# Altium project RockRTK.PrjPcb (part 2 of 2)

## Sheet SoC_Peripheral.SchDoc
size A4; SheetNumber: 21; SheetTotal: 22
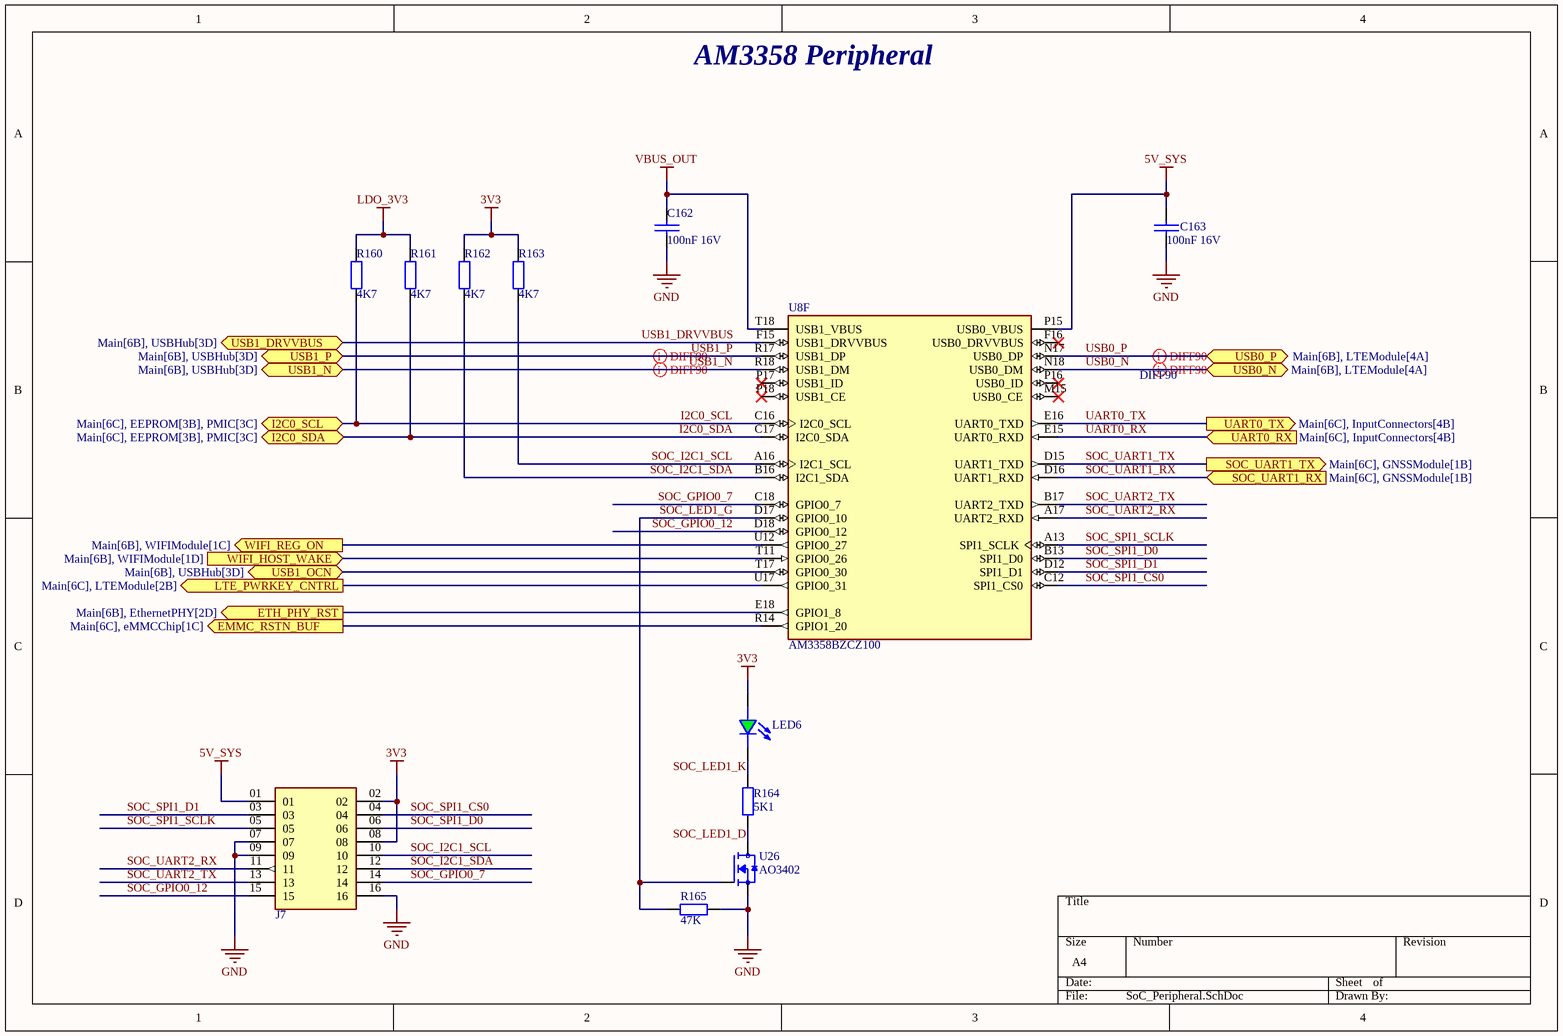
[diagram p12: SoC_Peripheral.SchDoc]

### Parts
C162  100nF 16V  [C_0402]
C163  100nF 16V  [C_0402]
J7  header_2.54_16pin_2row  [header_2.54_16pin_2row]  (value not drawn)
LED6  LED_0603_GREEN  [LED_0603]  (value not drawn)
R160  4K7  [R_0402]
R161  4K7  [R_0402]
R162  4K7  [R_0402]
R163  4K7  [R_0402]
R164  5K1  [R_0603]
R165  47K  [R_0603]
U8  AM3358BZCZ100  [BGA324C80P18X18_1500X1500X140]  (part F of 9)
U26  AO3402  [SOT-23-3]

### Ports
EMMC_RSTN_BUF (out, see Main[6C], eMMCChip[1C]), ETH_PHY_RST (out, see Main[6B], EthernetPHY[2D]), I2C0_SCL (bidir, see Main[6C], EEPROM[3B], PMIC[3C]), I2C0_SDA (bidir, see Main[6C], EEPROM[3B], PMIC[3C]), LTE_PWRKEY_CNTRL (out, see Main[6C], LTEModule[2B]), SOC_UART1_RX (in, see Main[6C], GNSSModule[1B]), SOC_UART1_TX (out, see Main[6C], GNSSModule[1B]), UART0_RX (in, see Main[6C], InputConnectors[4B]), UART0_TX (out, see Main[6C], InputConnectors[4B]), USB0_N (bidir, see Main[6B], LTEModule[4A]), USB0_P (bidir, see Main[6B], LTEModule[4A]), USB1_DRVVBUS (bidir, see Main[6B], USBHub[3D]), USB1_N (bidir, see Main[6B], USBHub[3D]), USB1_OCN (bidir, see Main[6B], USBHub[3D]), USB1_P (bidir, see Main[6B], USBHub[3D]), WIFI_HOST_WAKE (in, see Main[6B], WIFIModule[1D]), WIFI_REG_ON (out, see Main[6B], WIFIModule[1C])

### Nets
3V3: J7.02 J7.08 LED6.1(A) R162.2 R163.2
5V_SYS: C163.1 J7.01 U8.P15(USB0_VBUS)
GND: C162.2 C163.2 J7.07 J7.09 J7.16 R165.2 U26.2(S)
LDO_3V3: R160.2 R161.2
VBUS_OUT: C162.1 U8.T18(USB1_VBUS)
EMMC_RSTN_BUF: U8.R14(GPIO1_20) ; port EMMC_RSTN_BUF
ETH_PHY_RST: U8.E18(GPIO1_8) ; port ETH_PHY_RST
I2C0_SCL: R160.1 U8.C16(I2C0_SCL) ; port I2C0_SCL
I2C0_SDA: R161.1 U8.C17(I2C0_SDA) ; port I2C0_SDA
LTE_PWRKEY_CNTRL: U8.U17(GPIO0_31) ; port LTE_PWRKEY_CNTRL
SOC_GPIO0_7: J7.14 U8.C18(GPIO0_7)
SOC_GPIO0_12: J7.15 U8.D18(GPIO0_12)
SOC_I2C1_SCL: J7.10 R163.1 U8.A16(I2C1_SCL)
SOC_I2C1_SDA: J7.12 R162.1 U8.B16(I2C1_SDA)
SOC_LED1_D: R164.1 U26.3(D)
SOC_LED1_G: R165.1 U8.D17(GPIO0_10) U26.1(G)
SOC_LED1_K: LED6.2(C) R164.2
SOC_SPI1_CS0: J7.04 U8.C12(SPI1_CS0)
SOC_SPI1_D0: J7.06 U8.B13(SPI1_D0)
SOC_SPI1_D1: J7.03 U8.D12(SPI1_D1)
SOC_SPI1_SCLK: J7.05 U8.A13(SPI1_SCLK)
SOC_UART1_RX: U8.D16(UART1_RXD) ; port SOC_UART1_RX
SOC_UART1_TX: U8.D15(UART1_TXD) ; port SOC_UART1_TX
SOC_UART2_RX: J7.11 U8.A17(UART2_RXD)
SOC_UART2_TX: J7.13 U8.B17(UART2_TXD)
UART0_RX: U8.E15(UART0_RXD) ; port UART0_RX
UART0_TX: U8.E16(UART0_TXD) ; port UART0_TX
USB0_N: U8.N18(USB0_DM) ; port USB0_N
USB0_P: U8.N17(USB0_DP) ; port USB0_P
USB1_DRVVBUS: U8.F15(USB1_DRVVBUS) ; port USB1_DRVVBUS
USB1_N: U8.R18(USB1_DM) ; port USB1_N
USB1_OCN: U8.T17(GPIO0_30) ; port USB1_OCN
USB1_P: U8.R17(USB1_DP) ; port USB1_P
WIFI_HOST_WAKE: U8.T11(GPIO0_26) ; port WIFI_HOST_WAKE
WIFI_REG_ON: U8.U12(GPIO0_27) ; port WIFI_REG_ON

Not connected (* = marked no-connect by the designer): U8 F16(USB0_DRVVBUS)* M15(USB0_CE)* P16(USB0_ID)* P17(USB1_ID)* P18(USB1_CE)*

### Layout directives
differential pair; differential pair class DIFF90: USB0_N, USB0_P, USB1_N, USB1_P

### Notes on the sheet
- AM3358 Peripheral

### Library data of the parts
C162 C163 = C_0402: Capacitor 0402 SMD
R160-R163 = R_0402: Resistor 0402 SMD
R164 R165 = R_0603: Resistor 0603 SMD
U8 = AM3358BZCZ100: as U8 on sheet SoC_DDR; Manufacturer Part Number: AM3358BZCZ100; Datasheet Link: https://www.ti.com/lit/ds/symlink/am3358.pdf
U26 = AO3402: N-Channel 30 V 4A (Ta) 1.4W (Ta) Surface Mount SOT-23-3; Manufacturer: Alpha & Omega Semicon; Manufacturer Part Number: AO3402; ComponentLink1Description: Datasheet Link; ComponentLink1URL: https://www.lcsc.com/datasheet/lcsc_datasheet_2410121835_Alpha---Omega-Semicon-AO3402_C14385.pdf

## Sheet USBHub.SchDoc
size A4; SheetNumber: 10; SheetTotal: 22
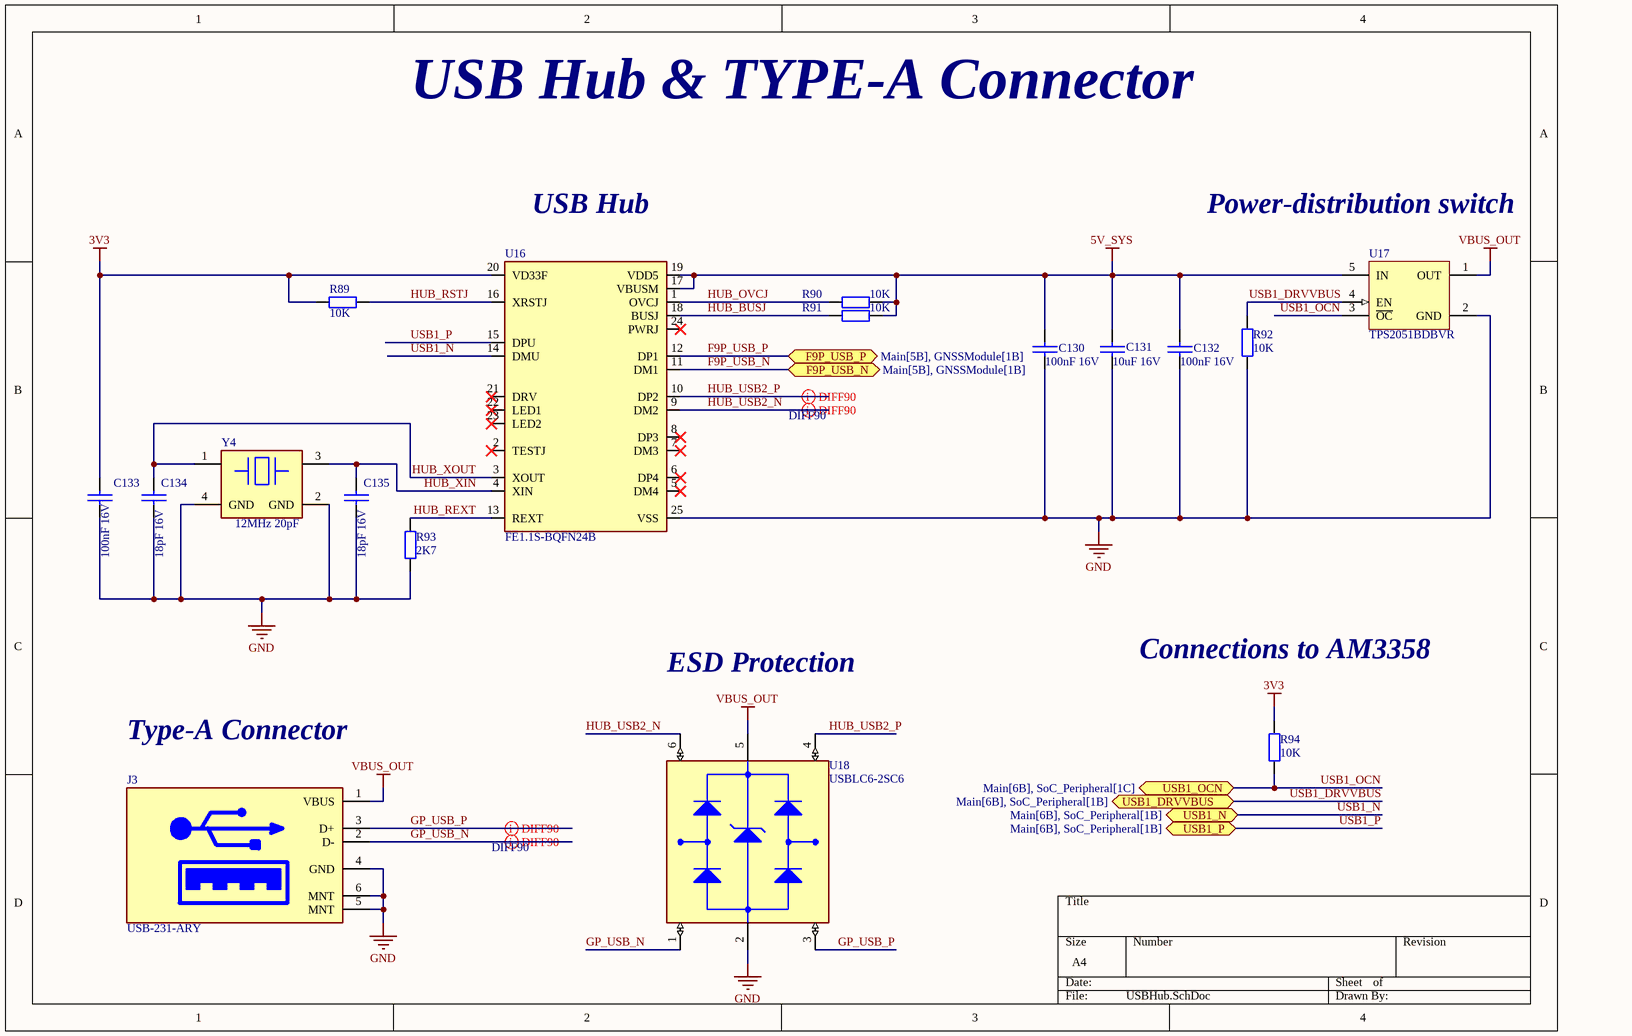
[diagram p13: USBHub.SchDoc]

### Parts
C130  100nF 16V  [C_0402]
C131  10uF 16V  [C_0603]
C132  100nF 16V  [C_0402]
C133  100nF 16V  [C_0402]
C134  18pF 16V  [C_0402]
C135  18pF 16V  [C_0402]
J3  USB-231-ARY  [TYPE-A_W14xD14.45xH7]
R89  10K  [R_0402]
R90  10K  [R_0402]
R91  10K  [R_0402]
R92  10K  [R_0402]
R93  2K7  [R_0402]
R94  10K  [R_0402]
U16  FE1.1S-BQFN24B  [QFN50P400X400X80-25N-D]
U17  TPS2051BDBVR  [DBV0005A_L]
U18  USBLC6-2SC6  [SOT-23-6]
Y4  12MHz 20pF  [CRYSTAL_SMD3225-4P]

### Ports
F9P_USB_N (bidir, see Main[5B], GNSSModule[1B]), F9P_USB_P (bidir, see Main[5B], GNSSModule[1B]), USB1_DRVVBUS (bidir, see Main[6B], SoC_Peripheral[1B]), USB1_N (bidir, see Main[6B], SoC_Peripheral[1B]), USB1_OCN (bidir, see Main[6B], SoC_Peripheral[1C]), USB1_P (bidir, see Main[6B], SoC_Peripheral[1B])

### Nets
3V3: C133.1 R89.2 R94.1 U16.20(VD33F)
5V_SYS: C130.1 C131.1 C132.1 R90.1 R91.1 U16.17(VBUSM) U16.19(VDD5) U17.5(IN)
GND: C130.2 C131.2 C132.2 C133.2 C134.1 C135.1 J3.4(GND) J3.5(MNT) J3.6(MNT) R92.2 R93.1 U16.25(VSS) U17.2(GND) U18.2(GND) Y4.2(GND) Y4.4(GND)
VBUS_OUT: J3.1(VBUS) U17.1(OUT) U18.5(VBUS)
F9P_USB_N: U16.11(DM1) ; port F9P_USB_N
F9P_USB_P: U16.12(DP1) ; port F9P_USB_P
GP_USB_N: J3.2(D-) U18.1(I/O1_IN)
GP_USB_P: J3.3(D+) U18.3(I/O2_IN)
HUB_BUSJ: R91.2 U16.18(BUSJ)
HUB_OVCJ: R90.2 U16.1(OVCJ)
HUB_REXT: R93.2 U16.13(REXT)
HUB_RSTJ: R89.1 U16.16(XRSTJ)
HUB_USB2_N: U16.9(DM2) U18.6(I/O1_OUT)
HUB_USB2_P: U16.10(DP2) U18.4(I/O2_OUT)
HUB_XIN: C135.2 U16.4(XIN) Y4.3(CRYSTAL_2)
HUB_XOUT: C134.2 U16.3(XOUT) Y4.1(CRYSTAL_1)
USB1_DRVVBUS: R92.1 U17.4(EN) ; port USB1_DRVVBUS
USB1_N: U16.14(DMU) ; port USB1_N
USB1_OCN: R94.2 U17.3(~{OC}) ; port USB1_OCN
USB1_P: U16.15(DPU) ; port USB1_P

Not connected (* = marked no-connect by the designer): U16 2(TESTJ)* 5(DM4)* 6(DP4)* 7(DM3)* 8(DP3)* 21(DRV)* 22(LED1)* 23(LED2)* 24(PWRJ)*

### Layout directives
differential pair; differential pair class DIFF90: GP_USB_N, GP_USB_P, HUB_USB2_N, HUB_USB2_P

### Notes on the sheet
- USB Hub & TYPE-A Connector
- USB Hub
- Power-distribution switch
- ESD Protection
- Connections to AM3358
- Type-A Connector

### Library data of the parts
C130 C132-C135 = C_0402: Capacitor 0402 SMD
C131 = C_0603: Capacitor 0603 SMD
J3 = USB-231-ARY: Type-A 1.5A USB 2.0 1 Bend-in 4P Female -20℃~+70℃  Plugin USB Connectors ROHS; Manufacturer: XUNPU; Manufacturer Part Number: USB-231-ARY; Datasheet Link: https://www.lcsc.com/datasheet/lcsc_datasheet_2409302332_XUNPU-USB-231-ARY_C720525.pdf
R89-R94 = R_0402: Resistor 0402 SMD
U16 = FE1.1S-BQFN24B: USB 2.0 4-PORT HuB CONTROLlER; Manufacturer: Terminus Tech; Manufacturer Part Number: FE1.1S-BQFN24B; Datasheet Link: https://taoic.oss-cn-hangzhou.aliyuncs.com/7545/product/johnma_1627012225000.pdf
U17 = CMP-2000-07277-1: Current-Limited, Power-Distribution Switch, 2.7 to 5.5 V, -40 to 85 degC, 5-Pin SOT-23 (DBV), Green (RoHS & no Sb/Br), Tape and Reel; Manufacturer: TexasInstruments; Number of Outputs: 1Output; Operating Supply Voltage: 2.7Vto5.5V; Supply Voltage - Min: 2.7V; Supply Voltage - Max: 5.5V; Current Limit: 1A; Development Kit: TPS2051BEVM; Output Current: 500mA; On Resistance - Max: 70mOhms; Package Version: 4073253-4/N, 12/2014; Mounting Technology: SurfaceMount; Packaging: Reel; Package / Case: SOT-23-5; Maximum Operating Temperature: +85C; Package Description: 5-Pin Small Outline Transistor, Body 2.9 x 1.6 mm, Pitch 0.95 mm; Type: HighSide; Product: USBCurrentLimitedPowerSwitches; Minimum Operating Temperature: -40C; Manufacturer URL: http://www.ti.com/; Factory Pack Quantity: 3000; Mounting Style: SMD/SMT; Brand: TexasInstruments; Package Reference: DBV5; Package URL: http://www.ti.com/lit/ml/mpds018l/mpds018l.pdf; Datasheet URL: http://www.ti.com/general/docs/lit/getliterature.tsp?genericPartNumber=TPS2051B&fileType=pdf; Product Category: PowerSwitchICs-PowerDistribution; Series: TPS2051B; Datasheet Version: Rev. L, 06/2011; RoHS: Details
U18 = USBLC6-2SC6: 6A 12V 150W 6V Unidirectional 5V SOT-23-6 ESD and Surge Protection (TVS/ESD) ROHS; Manufacturer: STMicroelectronics; Manufacturer Part Number: USBLC6-2SC6; Datasheet Link: https://www.st.com/resource/en/datasheet/usblc6-2.pdf
Y4 = X322512MSB4SI: 12MHz Surface Mount Crystal 20pF ±10ppm ±20ppm SMD3225-4P Crystals ROHS; Manufacturer: YXC Crystal Oscillators; Manufacturer Part Number: X322512MSB4SI; Datasheet Link: https://www.lcsc.com/datasheet/lcsc_datasheet_2411121006_YXC-Crystal-Oscillators-X322524MSB4SI_C15643.pdf

## Sheet GNSSModule.SchDoc
size A4; SheetNumber: 12; SheetTotal: 22
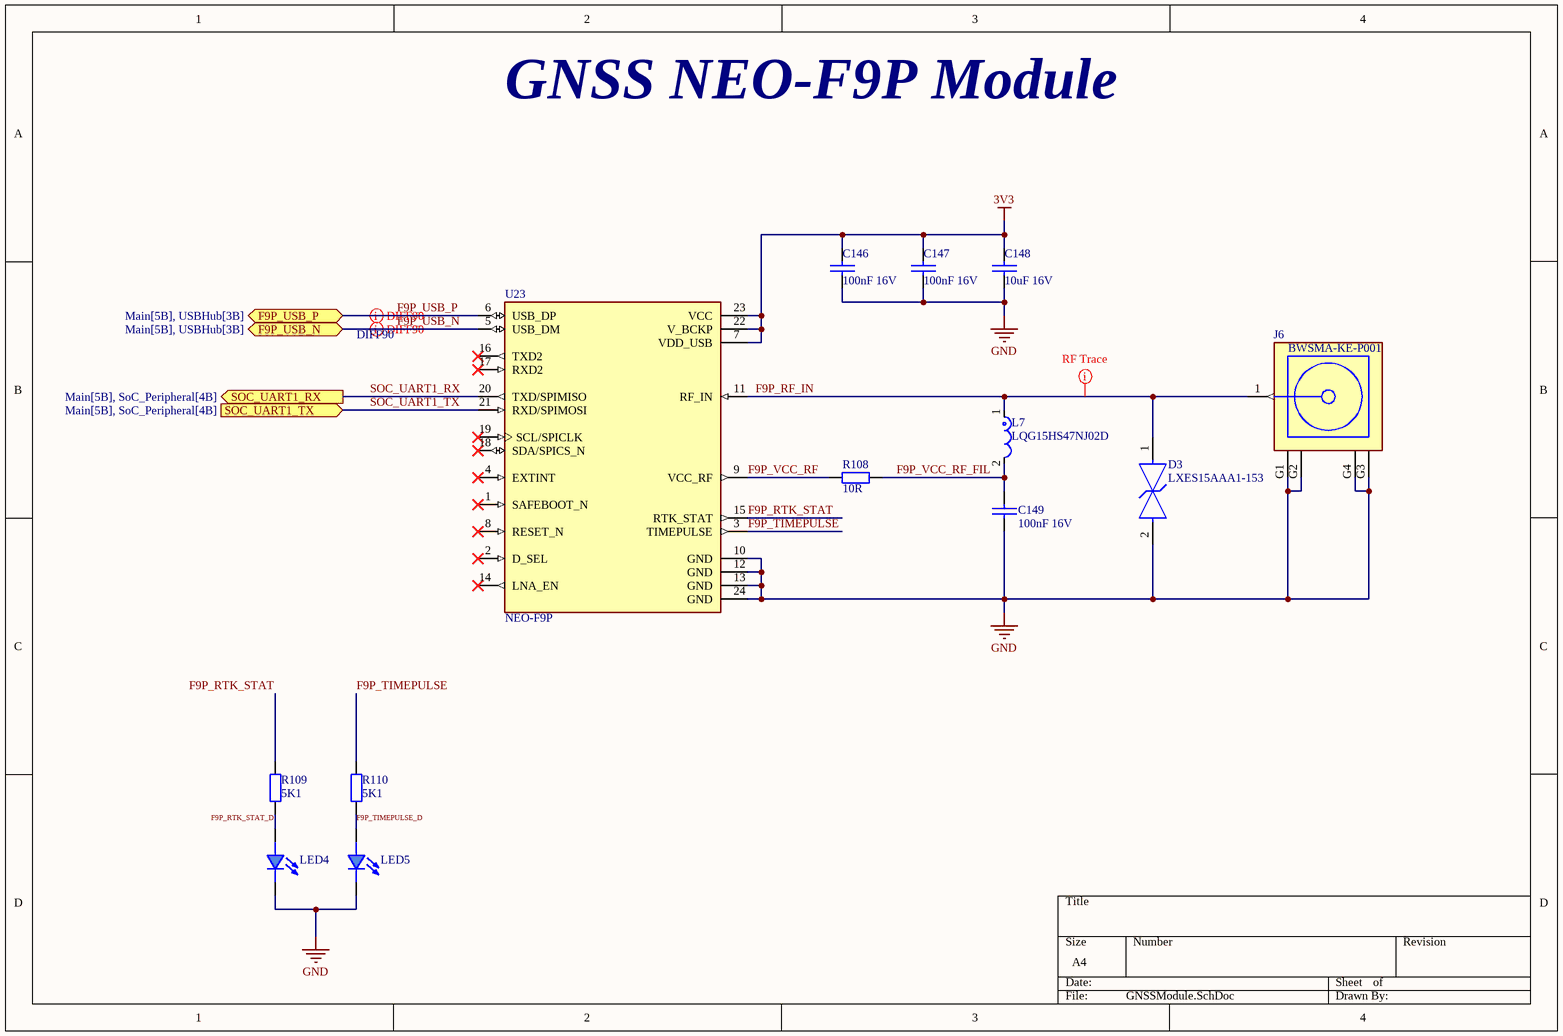
[diagram p14: GNSSModule.SchDoc]

### Parts
C146  100nF 16V  [C_0402]
C147  100nF 16V  [C_0402]
C148  10uF 16V  [C_0603]
C149  100nF 16V  [C_0402]
D3  LXES15AAA1-153  [FP-LXES15-MFG]
J6  BWSMA-KE-P001  [BATWIRELESS_BWSMA-KE-P001]
L7  LQG15HS47NJ02D  [FP-LQG15HH_02-IPC_B]
LED4  LED_0603_BLUE  [LED_0603]  (value not drawn)
LED5  LED_0603_BLUE  [LED_0603]  (value not drawn)
R108  10R  [R_0402]
R109  5K1  [R_0603]
R110  5K1  [R_0603]
U23  NEO-F9P  [NEO-F9P]

### Ports
F9P_USB_N (bidir, see Main[5B], USBHub[3B]), F9P_USB_P (bidir, see Main[5B], USBHub[3B]), SOC_UART1_RX (out, see Main[5B], SoC_Peripheral[4B]), SOC_UART1_TX (in, see Main[5B], SoC_Peripheral[4B])

### Nets
3V3: C146.1 C147.1 C148.1 U23.7(VDD_USB) U23.22(V_BCKP) U23.23(VCC)
GND: C146.2 C147.2 C148.2 C149.2 D3.2 J6.G1(GND) J6.G2(GND) J6.G3(GND) J6.G4(GND) LED4.2(C) LED5.2(C) U23.10(GND) U23.12(GND) U23.13(GND) U23.24(GND)
F9P_RF_IN: D3.1 J6.1(SIG) L7.1 U23.11(RF_IN)
F9P_RTK_STAT: R109.1 U23.15(RTK_STAT)
F9P_RTK_STAT_D: LED4.1(A) R109.2
F9P_TIMEPULSE: R110.1 U23.3(TIMEPULSE)
F9P_TIMEPULSE_D: LED5.1(A) R110.2
F9P_USB_N: U23.5(USB_DM) ; port F9P_USB_N
F9P_USB_P: U23.6(USB_DP) ; port F9P_USB_P
F9P_VCC_RF: R108.2 U23.9(VCC_RF)
F9P_VCC_RF_FIL: C149.1 L7.2 R108.1
SOC_UART1_RX: U23.20(TXD/SPIMISO) ; port SOC_UART1_RX
SOC_UART1_TX: U23.21(RXD/SPIMOSI) ; port SOC_UART1_TX

Not connected (* = marked no-connect by the designer): U23 1(SAFEBOOT_N)* 2(D_SEL)* 4(EXTINT)* 8(RESET_N)* 14(LNA_EN)* 16(TXD2)* 17(RXD2)* 18(SDA/SPICS_N)* 19(SCL/SPICLK)*

### Layout directives
differential pair; differential pair class DIFF90: F9P_USB_N, F9P_USB_P
net class RF_TRACE: F9P_RF_IN

### Notes on the sheet
- GNSS NEO-F9P Module

### Library data of the parts
C146 C147 C149 = C_0402: Capacitor 0402 SMD
C148 = C_0603: Capacitor 0603 SMD
D3 = CMP-06195-000025-1: TVS DIODE 4V 1005; Power Line Protection: No; Number of Bidirectional Channels: 1; Resistor Type: Zener; Case/Package: 0402; Max Operating Temperature: 85°C; Case Code (Metric): 1005; Packaging: Tape and Reel; Min Operating Temperature: -40°C; Mount: Surface Mount; Reverse Standoff Voltage: 4V; Case Code (Imperial): 0402
J6 = BWSMA-KE-P001: 1 Inner Hole SMA Board-End Staggered pins 50Ω 5.2mm SMD Coaxial Connectors (RF) ROHS; Manufacturer: BAT WIRELESS; Manufacturer Part Number: BWSMA-KE-P001; Datasheet Link: https://www.lcsc.com/datasheet/lcsc_datasheet_2410121647_BAT-WIRELESS-BWSMA-KE-P001_C496550.pdf
L7 = CMP-06042-015783-1: Multilayer type RF Inductor 47nH ±5% 0.72Ω 300mA 0402; Core Material: Air; DC Resistance (DCR): 720mR; DC Current: 200mA; Shielding: Unshielded; Self Resonant Frequency: 1GHz; Q Factor: 8; Test Frequency: 100MHz; Tolerance: 5%; Packaging: Tape and Reel; Case Code (Imperial): 0402; Max Operating Temperature: 125°C; Military Standard: Not; Length: 1mm; Radiation Hardening: No; Height: 0.5mm; Min Operating Temperature: -55°C; Width: 0.02inch; Inductance: 47nH; Lead Free: Lead Free; Termination: SMD/SMT; Height - Seated (Max): 0.022inch; Rated Current-Max: 200mA; Case/Package: 0402; Max DC Current: 200mA; Series: LQG15HS; Case Code (Metric): 1005; Mount: Surface Mount; Current Rating: 200mA; Depth: 0.55mm; Package Quantity: 1
R108 = R_0402: Resistor 0402 SMD
R109 R110 = R_0603: Resistor 0603 SMD
U23 = NEO-F9P: RF Receiver BeiDou, Galileo, GLONASS, GNSS, GPS -167dBm 921.6kbps; Manufacturer: u-blox; Manufacturer Part Number: NEO-F9P-15B; Datasheet Link: https://content.u-blox.com/sites/default/files/documents/NEO-F9P-15B_DataSheet_UBX-22021920.pdf

## Sheet LTEModule.SchDoc
size A4; SheetNumber: 11; SheetTotal: 22
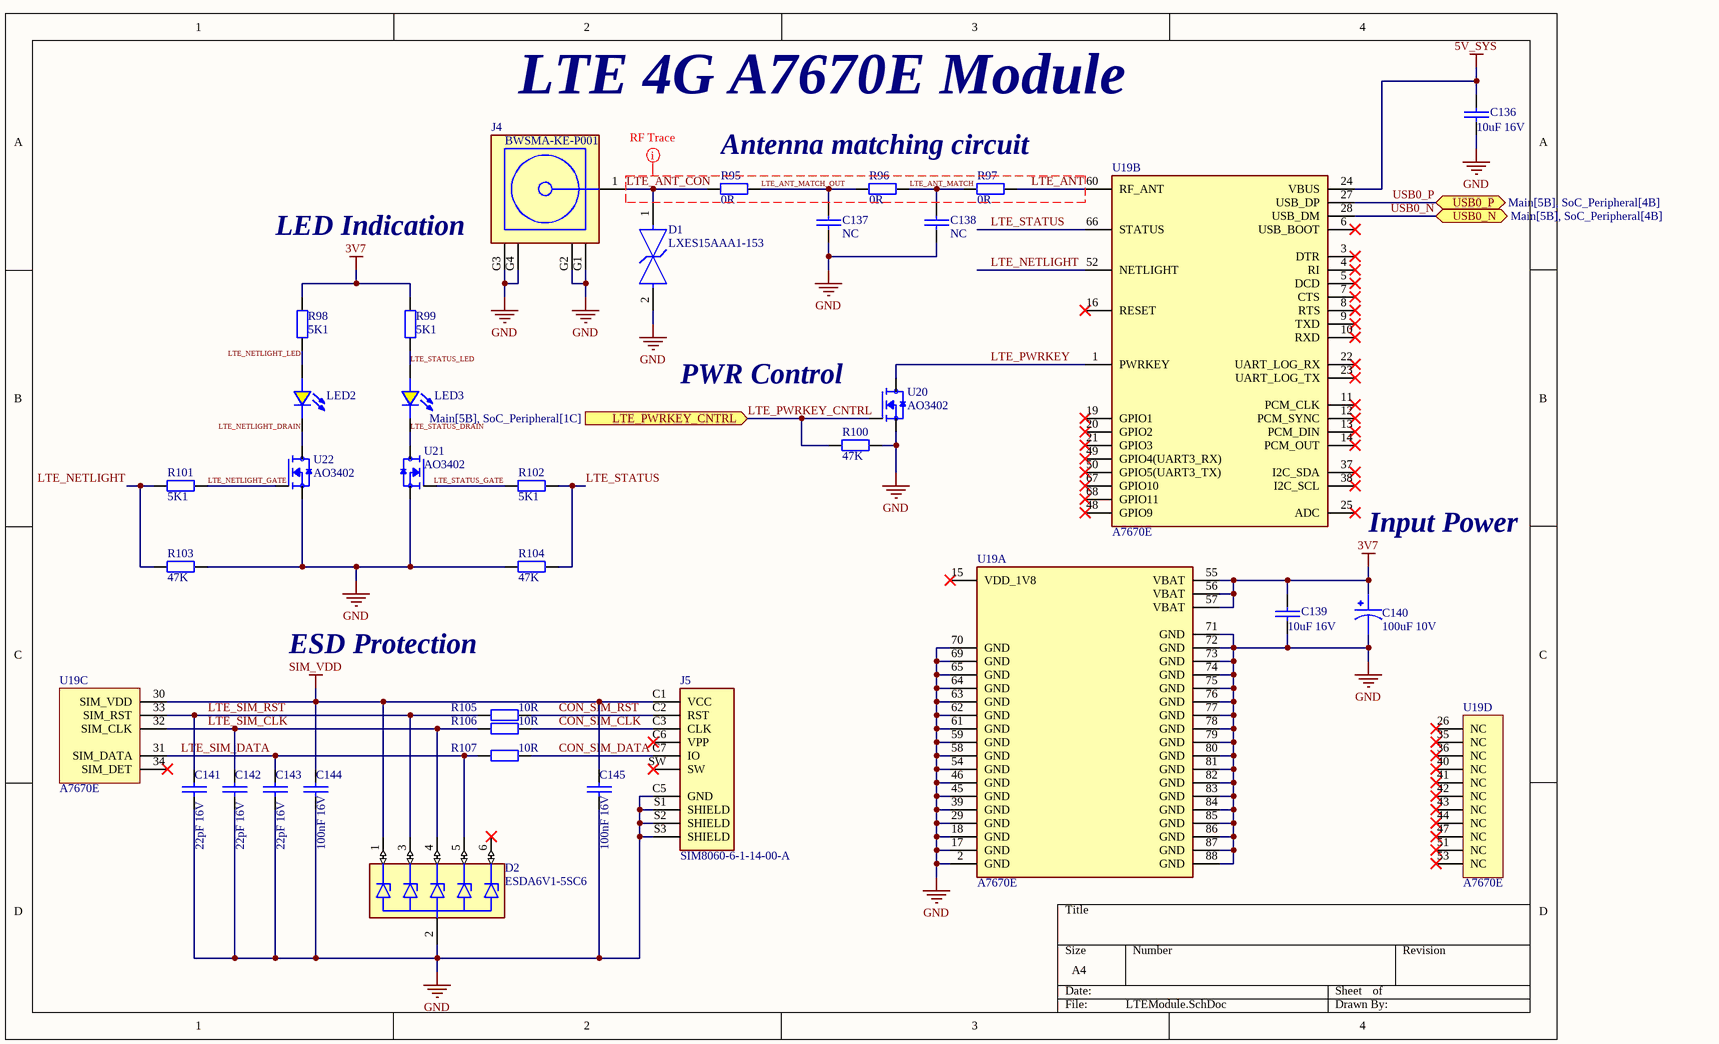
[diagram p15: LTEModule.SchDoc]

### Parts
C136  10uF 16V  [C_0603]
C137  NC  [C_0402]
C138  NC  [C_0402]
C139  10uF 16V  [C_0603]
C140  100uF 10V  [C_CASE-B]
C141  22pF 16V  [C_0402]
C142  22pF 16V  [C_0402]
C143  22pF 16V  [C_0402]
C144  100nF 16V  [C_0402]
C145  100nF 16V  [C_0402]
D1  LXES15AAA1-153  [FP-LXES15-MFG]
D2  ESDA6V1-5SC6  [SOT-23-6]
J4  BWSMA-KE-P001  [BATWIRELESS_BWSMA-KE-P001]
J5  SIM8060-6-1-14-00-A  [SIM8060-6-1-14-00-A]
LED2  LED_0603_YELLOW  [LED_0603]  (value not drawn)
LED3  LED_0603_YELLOW  [LED_0603]  (value not drawn)
R95  0R  [R_0402]
R96  0R  [R_0402]
R97  0R  [R_0402]
R98  5K1  [R_0603]
R99  5K1  [R_0603]
R100  47K  [R_0603]
R101  5K1  [R_0603]
R102  5K1  [R_0603]
R103  47K  [R_0603]
R104  47K  [R_0603]
R105  10R  [R_0402]
R106  10R  [R_0402]
R107  10R  [R_0402]
U19  A7670E  [A7670]  (parts A,B,C,D of 4)
U20  AO3402  [SOT-23-3]
U21  AO3402  [SOT-23-3]
U22  AO3402  [SOT-23-3]

### Ports
LTE_PWRKEY_CNTRL (in, see Main[5B], SoC_Peripheral[1C]), USB0_N (bidir, see Main[5B], SoC_Peripheral[4B]), USB0_P (bidir, see Main[5B], SoC_Peripheral[4B])

### Nets
3V7: C139.1 C140.1 R98.1 R99.1 U19.55(VBAT) U19.56(VBAT) U19.57(VBAT)
5V_SYS: C136.1 U19.24(VBUS)
GND: C136.2 C137.2 C138.2 C139.2 C140.2 C141.2 C142.2 C143.2 C144.2 C145.2 D1.2 D2.2(GND) J4.G1(GND) J4.G2(GND) J4.G3(GND) J4.G4(GND) J5.C5(GND) J5.S1(SHIELD) J5.S2(SHIELD) J5.S3(SHIELD) R100.2 R103.2 R104.1 U19.2(GND) U19.17(GND) U19.18(GND) U19.29(GND) U19.39(GND) U19.45(GND) U19.46(GND) U19.54(GND) U19.58(GND) U19.59(GND) U19.61(GND) U19.62(GND) U19.63(GND) U19.64(GND) U19.65(GND) U19.69(GND) U19.70(GND) U19.71(GND) U19.72(GND) U19.73(GND) U19.74(GND) U19.75(GND) U19.76(GND) U19.77(GND) U19.78(GND) U19.79(GND) U19.80(GND) U19.81(GND) U19.82(GND) U19.83(GND) U19.84(GND) U19.85(GND) U19.86(GND) U19.87(GND) U19.88(GND) U20.2(S) U21.2(S) U22.2(S)
SIM_VDD: C144.1 C145.1 D2.1(I/O1) J5.C1(VCC) U19.30(SIM_VDD)
CON_SIM_CLK: J5.C3(CLK) R106.1
CON_SIM_DATA: J5.C7(IO) R107.1
CON_SIM_RST: J5.C2(RST) R105.1
LTE_ANT: R97.2 U19.60(RF_ANT)
LTE_ANT_CON: D1.1 J4.1(SIG) R95.1
LTE_ANT_MATCH: C138.1 R96.2 R97.1
LTE_ANT_MATCH_OUT: C137.1 R95.2 R96.1
LTE_NETLIGHT: R101.1 R103.1 U19.52(NETLIGHT)
LTE_NETLIGHT_DRAIN: LED2.2(C) U22.3(D)
LTE_NETLIGHT_GATE: R101.2 U22.1(G)
LTE_NETLIGHT_LED: LED2.1(A) R98.2
LTE_PWRKEY: U19.1(PWRKEY) U20.3(D)
LTE_PWRKEY_CNTRL: R100.1 U20.1(G) ; port LTE_PWRKEY_CNTRL
LTE_SIM_CLK: C142.1 D2.4(I/O3) R106.2 U19.32(SIM_CLK)
LTE_SIM_DATA: C143.1 D2.5(I/O4) R107.2 U19.31(SIM_DATA)
LTE_SIM_RST: C141.1 D2.3(I/O2) R105.2 U19.33(SIM_RST)
LTE_STATUS: R102.2 R104.2 U19.66(STATUS)
LTE_STATUS_DRAIN: LED3.2(C) U21.3(D)
LTE_STATUS_GATE: R102.1 U21.1(G)
LTE_STATUS_LED: LED3.1(A) R99.2
USB0_N: U19.28(USB_DM) ; port USB0_N
USB0_P: U19.27(USB_DP) ; port USB0_P

Not connected (* = marked no-connect by the designer): D2 6(I/O5)*; J5 C6(VPP)* SW*; U19 3(DTR)* 4(RI)* 5(DCD)* 6(USB_BOOT)* 7(CTS)* 8(RTS)* 9(TXD)* 10(RXD)* 11(PCM_CLK)* 12(PCM_SYNC)* 13(PCM_DIN)* 14(PCM_OUT)* 15(VDD_1V8)* 16(RESET)* 19(GPIO1)* 20(GPIO2)* 21(GPIO3)* 22(UART_LOG_RX)* 23(UART_LOG_TX)* 25(ADC)* 26(NC)* 34(SIM_DET)* 35(NC)* 36(NC)* 37(I2C_SDA)* 38(I2C_SCL)* 40(NC)* 41(NC)* 42(NC)* 43(NC)* 44(NC)* 47(NC)* 48(GPIO9)* 49(GPIO4(UART3_RX))* 50(GPIO5(UART3_TX))* 51(NC)* 53(NC)* 67(GPIO10)* 68(GPIO11)*

### Layout directives
net class RF_TRACE: LTE_ANT, LTE_ANT_CON, LTE_ANT_MATCH, LTE_ANT_MATCH_OUT

### Notes on the sheet
- LTE 4G A7670E Module
- Antenna matching circuit
- (near J4) LED Indication
- PWR Control
- Input Power
- ESD Protection

### Library data of the parts
C136 C139 = C_0603: Capacitor 0603 SMD
C137 C138 C141-C145 = C_0402: Capacitor 0402 SMD
C140 = C_CASE-B-3528-21: Tantalum capacitor CASE-B-3528-21
D1 = CMP-06195-000025-1: as D3 on sheet GNSSModule; Resistor Type: Zener; Case/Package: 0402; Max Operating Temperature: 85°C; Case Code (Metric): 1005; Packaging: Tape and Reel; Min Operating Temperature: -40°C; Mount: Surface Mount; Reverse Standoff Voltage: 4V; Case Code (Imperial): 0402
D2 = ESDA6V1-5SC6: 11.4V Clamp 7A (8/20µs) Ipp Tvs Diode Surface Mount SOT-23-6; Manufacturer: STMicroelectronics; Manufacturer Part Number: ESDA6V1-5SC6; ComponentLink1Description: Datasheet Link; ComponentLink1URL: https://www.st.com/resource/en/datasheet/esda6v1-5sc6.pdf
J4 = BWSMA-KE-P001: as J6 on sheet GNSSModule; Manufacturer Part Number: BWSMA-KE-P001; Datasheet Link: https://www.lcsc.com/datasheet/lcsc_datasheet_2410121647_BAT-WIRELESS-BWSMA-KE-P001_C496550.pdf
J5 = SIM8060-6-1-14-00-A: 6 Position Card Connector NANO SIM Surface Mount, Right Angle Gold; Manufacturer: Global Connector Technology; Manufacturer Part Number: SIM8060-6-1-14-00-A; ComponentLink1Description: Datasheet Link; ComponentLink1URL: https://www.tme.eu/Document/cb0a1a43149419081a289087b1ef4c50/SIM8060-6-0-14-00A.pdf
R95-R97 R105-R107 = R_0402: Resistor 0402 SMD
R98-R104 = R_0603: Resistor 0603 SMD
U19 = A7670E: LTE Cat 1 module; Manufacturer: SIMCom Wireless Solutions; Manufacturer Part Number: A7670E-LASE; Datasheet Link: https://nostris.ee/pdf/A7670%20Series%20Hardware%20Design_V1.00.pdf
U20-U22 = AO3402: N-Channel 30 V 4A (Ta) 1.4W (Ta) Surface Mount SOT-23-3; Manufacturer: Alpha & Omega Semicon; Manufacturer Part Number: AO3402; ComponentLink1Description: Datasheet Link; ComponentLink1URL: https://www.lcsc.com/datasheet/lcsc_datasheet_2410121835_Alpha---Omega-Semicon-AO3402_C14385.pdf

## Sheet WIFIModule.SchDoc
size A4; SheetNumber: 13; SheetTotal: 22
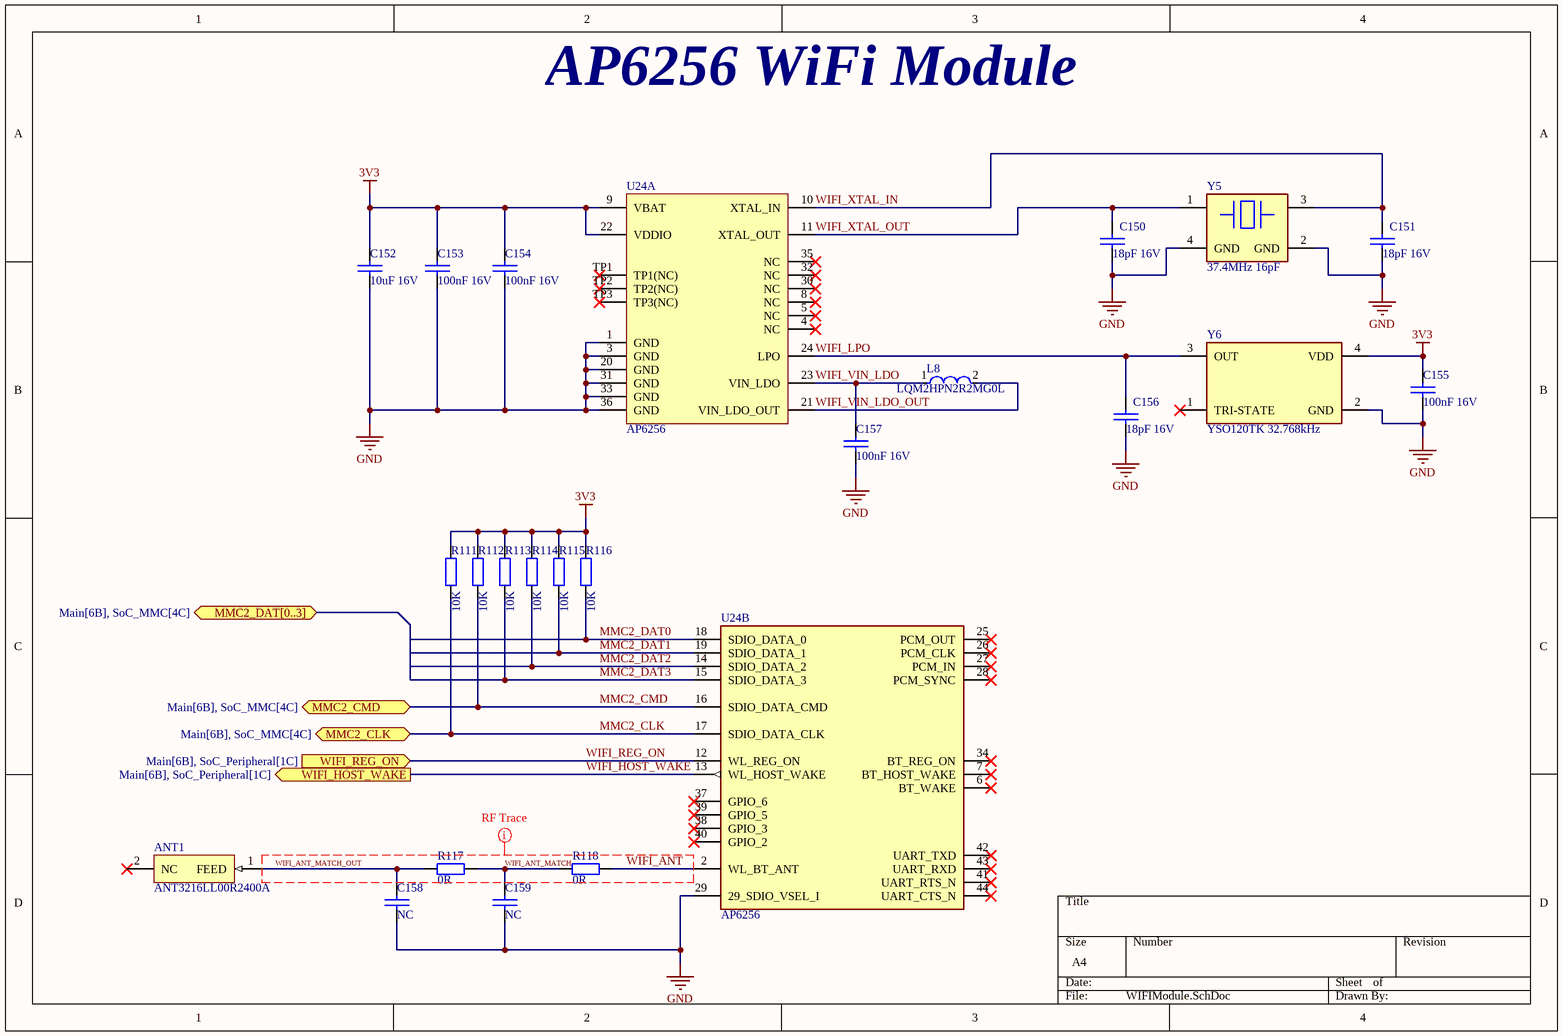
[diagram p16: WIFIModule.SchDoc]

### Parts
ANT1  ANT3216LL00R2400A  [ANT_1206]
C150  18pF 16V  [C_0402]
C151  18pF 16V  [C_0402]
C152  10uF 16V  [C_0603]
C153  100nF 16V  [C_0402]
C154  100nF 16V  [C_0402]
C155  100nF 16V  [C_0402]
C156  18pF 16V  [C_0402]
C157  100nF 16V  [C_0402]
C158  NC  [C_0402]
C159  NC  [C_0402]
L8  LQM2HPN2R2MG0L  [FP-LQM2HPN_G0-IPC_C]
R111  10K  [R_0402]
R112  10K  [R_0402]
R113  10K  [R_0402]
R114  10K  [R_0402]
R115  10K  [R_0402]
R116  10K  [R_0402]
R117  0R  [R_0402]
R118  0R  [R_0402]
U24  AP6256  [AP6256]  (parts A,B of 2)
Y5  37.4MHz 16pF  [CRYSTAL_SMD3225-4P]
Y6  YSO120TK 32.768kHz  [CRYSTAL_SMD3225-4P]

### Ports
MMC2_CLK (bidir, see Main[6B], SoC_MMC[4C]), MMC2_CMD (bidir, see Main[6B], SoC_MMC[4C]), MMC2_DAT[0..3] (bidir, see Main[6B], SoC_MMC[4C]), WIFI_HOST_WAKE (out, see Main[6B], SoC_Peripheral[1C]), WIFI_REG_ON (in, see Main[6B], SoC_Peripheral[1C])

### Nets
3V3: C152.1 C153.1 C154.1 C155.1 R111.2 R112.2 R113.2 R114.2 R115.2 R116.2 U24.9(VBAT) U24.22(VDDIO) Y6.4(VDD)
GND: C150.1 C151.1 C152.2 C153.2 C154.2 C155.2 C156.1 C157.2 C158.2 C159.2 U24.1(GND) U24.3(GND) U24.20(GND) U24.29(29_SDIO_VSEL_I) U24.31(GND) U24.33(GND) U24.36(GND) Y5.2(GND) Y5.4(GND) Y6.2(GND)
MMC2_CLK: R111.1 U24.17(SDIO_DATA_CLK) ; port MMC2_CLK
MMC2_CMD: R112.1 U24.16(SDIO_DATA_CMD) ; port MMC2_CMD
MMC2_DAT0: R116.1 U24.18(SDIO_DATA_0)
MMC2_DAT1: R115.1 U24.19(SDIO_DATA_1)
MMC2_DAT2: R114.1 U24.14(SDIO_DATA_2)
MMC2_DAT3: R113.1 U24.15(SDIO_DATA_3)
WIFI_ANT: R118.2 U24.2(WL_BT_ANT)
WIFI_ANT_MATCH: C159.1 R117.2 R118.1
WIFI_ANT_MATCH_OUT: ANT1.1(FEED) C158.1 R117.1
WIFI_HOST_WAKE: U24.13(WL_HOST_WAKE) ; port WIFI_HOST_WAKE
WIFI_LPO: C156.2 U24.24(LPO) Y6.3(OUT)
WIFI_REG_ON: U24.12(WL_REG_ON) ; port WIFI_REG_ON
WIFI_VIN_LDO: C157.1 L8.1 U24.23(VIN_LDO)
WIFI_VIN_LDO_OUT: L8.2 U24.21(VIN_LDO_OUT)
WIFI_XTAL_IN: C151.2 U24.10(XTAL_IN) Y5.3(CRYSTAL_2)
WIFI_XTAL_OUT: C150.2 U24.11(XTAL_OUT) Y5.1(CRYSTAL_1)

Not connected (* = marked no-connect by the designer): ANT1 2(NC)*; U24 4(NC)* 5(NC)* 6(BT_WAKE)* 7(BT_HOST_WAKE)* 8(NC)* 25(PCM_OUT)* 26(PCM_CLK)* 27(PCM_IN)* 28(PCM_SYNC)* 30(NC)* 32(NC)* 34(BT_REG_ON)* 35(NC)* 37(GPIO_6)* 38(GPIO_3)* 39(GPIO_5)* 40(GPIO_2)* 41(UART_RTS_N)* 42(UART_TXD)* 43(UART_RXD)* 44(UART_CTS_N)* TP1(TP1(NC))* TP2(TP2(NC))* TP3(TP3(NC))*; Y6 1(TRI-STATE)*

### Layout directives
net class RF_TRACE: WIFI_ANT, WIFI_ANT_MATCH, WIFI_ANT_MATCH_OUT

### Notes on the sheet
- AP6256 WiFi Module

### Library data of the parts
ANT1 = ANT3216LL00R2400A: 5.05dBi Chip Antenna Linear 160MHz 2450MHz 1W 1206 Antennas ROHS; Manufacturer: YAGEO; Manufacturer Part Number: ANT3216LL00R2400A; ComponentLink1Description: Datasheet Link; ComponentLink1URL: https://www.lcsc.com/datasheet/lcsc_datasheet_2410121536_YAGEO-ANT3216LL00R2400A_C293767.pdf
C150 C151 C153-C159 = C_0402: Capacitor 0402 SMD
C152 = C_0603: Capacitor 0603 SMD
L8 = CMP-1662-00028-2: Multilayer Type Inductor for Power Lines, 1008 (2520), 2.2μH, 20%, 0.1Ω, 1.3A; Core Material: Ferrite; DC Resistance (DCR): 100mR; Inductance: 2.2uH; Test Frequency: 1MHz; Self Resonant Frequency: 40MHz; Shielding: Shielded; Depth: 2.2mm; Length: 2.5mm; Max DC Current: 1.3A; Military Standard: Not; Current Rating: 1.3A; Termination: SMD/SMT; Radiation Hardening: No; Tolerance: 20%; Height: 1.2mm; Case Code (Metric): 2520; DC Current: 1.3A; Inductance Tolerance: 20%; Packaging: Tape and Reel; Width: 2mm; REACH SVHC: No SVHC; Mount: Surface Mount; Max Operating Temperature: 125°C; Lead Free: Lead Free; Case/Package: 1008; Case Code (Imperial): 1008; Series: LQM2HP_G0; Height - Seated (Max): 0.039inch; Package Quantity: 3000; Min Operating Temperature: -55°C
R111-R118 = R_0402: Resistor 0402 SMD
U24 = AP6256: Wi-Fi and Bluetooth 802.11a/b/g/n/ac; Manufacturer: AMPAK Tech; Manufacturer Part Number: AP6256; ComponentLink1Description: Datasheet Link; ComponentLink1URL: https://files.pine64.org/doc/datasheet/PinebookPro/AP6256%20datasheet_V1.7_12282018.pdf
Y5 = E3SB37E0X0004E: 37.4MHz 16pF ±10ppm ±10ppm SMD3225-4P Crystals ROHS; Manufacturer: Hosonic Elec; ComponentLink1Description: Datasheet Link; ComponentLink1URL: https://www.lcsc.com/datasheet/lcsc_datasheet_2410121523_Hosonic-Elec-E3SB37E0X0004E_C2687892.pdf; Manufacturer Part Number: E3SB37E0X0004E
Y6 = YSO120TK: 1.8V~3.3V ±10ppm ±20ppm CMOS 32.768kHz SMD3225-4P Crystal Oscillators ROHS; Manufacturer: YXC Crystal Oscillators; Manufacturer Part Number: OK2EL89CJI-111YLC-32.768K; ComponentLink1Description: Datasheet Link; ComponentLink1URL: https://www.lcsc.com/datasheet/lcsc_datasheet_2407310922_YXC-Crystal-Oscillators-OK2EL89CJI-111YLC-32-768K_C5280579.pdf

## Sheet EEPROM.SchDoc
size A4; SheetNumber: 14; SheetTotal: 22
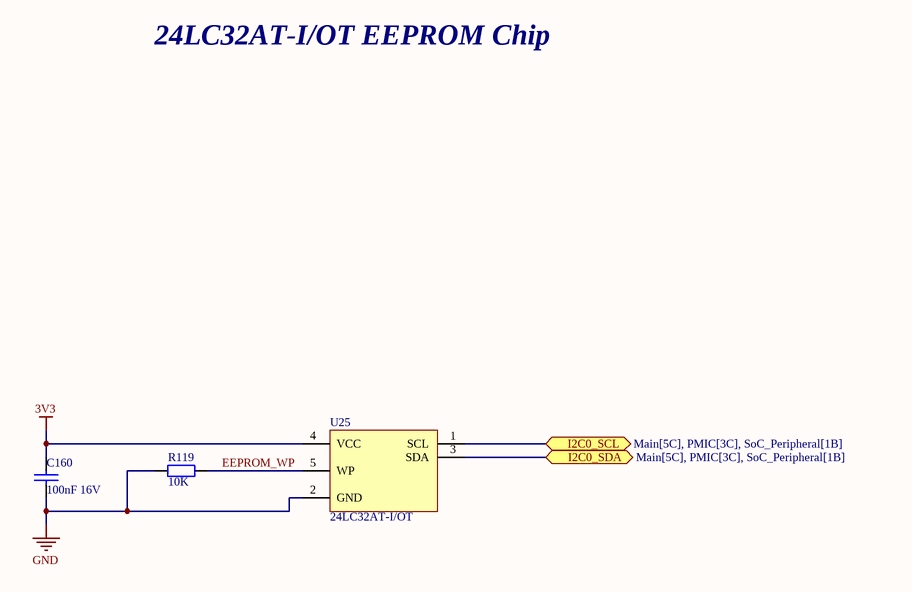
[diagram p17: EEPROM.SchDoc]

### Parts
C160  100nF 16V  [C_0402]
R119  10K  [R_0402]
U25  24LC32AT-I/OT  [SOT-23-5]

### Ports
I2C0_SCL (bidir, see Main[5C], PMIC[3C], SoC_Peripheral[1B]), I2C0_SDA (bidir, see Main[5C], PMIC[3C], SoC_Peripheral[1B])

### Nets
3V3: C160.1 U25.4(VCC)
GND: C160.2 R119.2 U25.2(GND)
EEPROM_WP: R119.1 U25.5(WP)
I2C0_SCL: U25.1(SCL) ; port I2C0_SCL
I2C0_SDA: U25.3(SDA) ; port I2C0_SDA

### Notes on the sheet
- 24LC32AT-I/OT EEPROM Chip

### Library data of the parts
C160 = C_0402: Capacitor 0402 SMD
R119 = R_0402: Resistor 0402 SMD
U25 = 24LC32AT-I/OT: 32Kbit 400kHz I2C SOT-23-5 EEPROM ROHS; Manufacturer: Microchip Tech; Manufacturer Part Number: 24LC32AT-I/OT; ComponentLink1Description: Datasheet Link; ComponentLink1URL: https://ww1.microchip.com/downloads/aemDocuments/documents/MPD/ProductDocuments/DataSheets/24AA32A-24LC32A-32-Kbit-I2C-Serial-EEPROM-DS20001713.pdf

## Sheet EthernetPHY.SchDoc
size A3; SheetNumber: 8; SheetTotal: 22
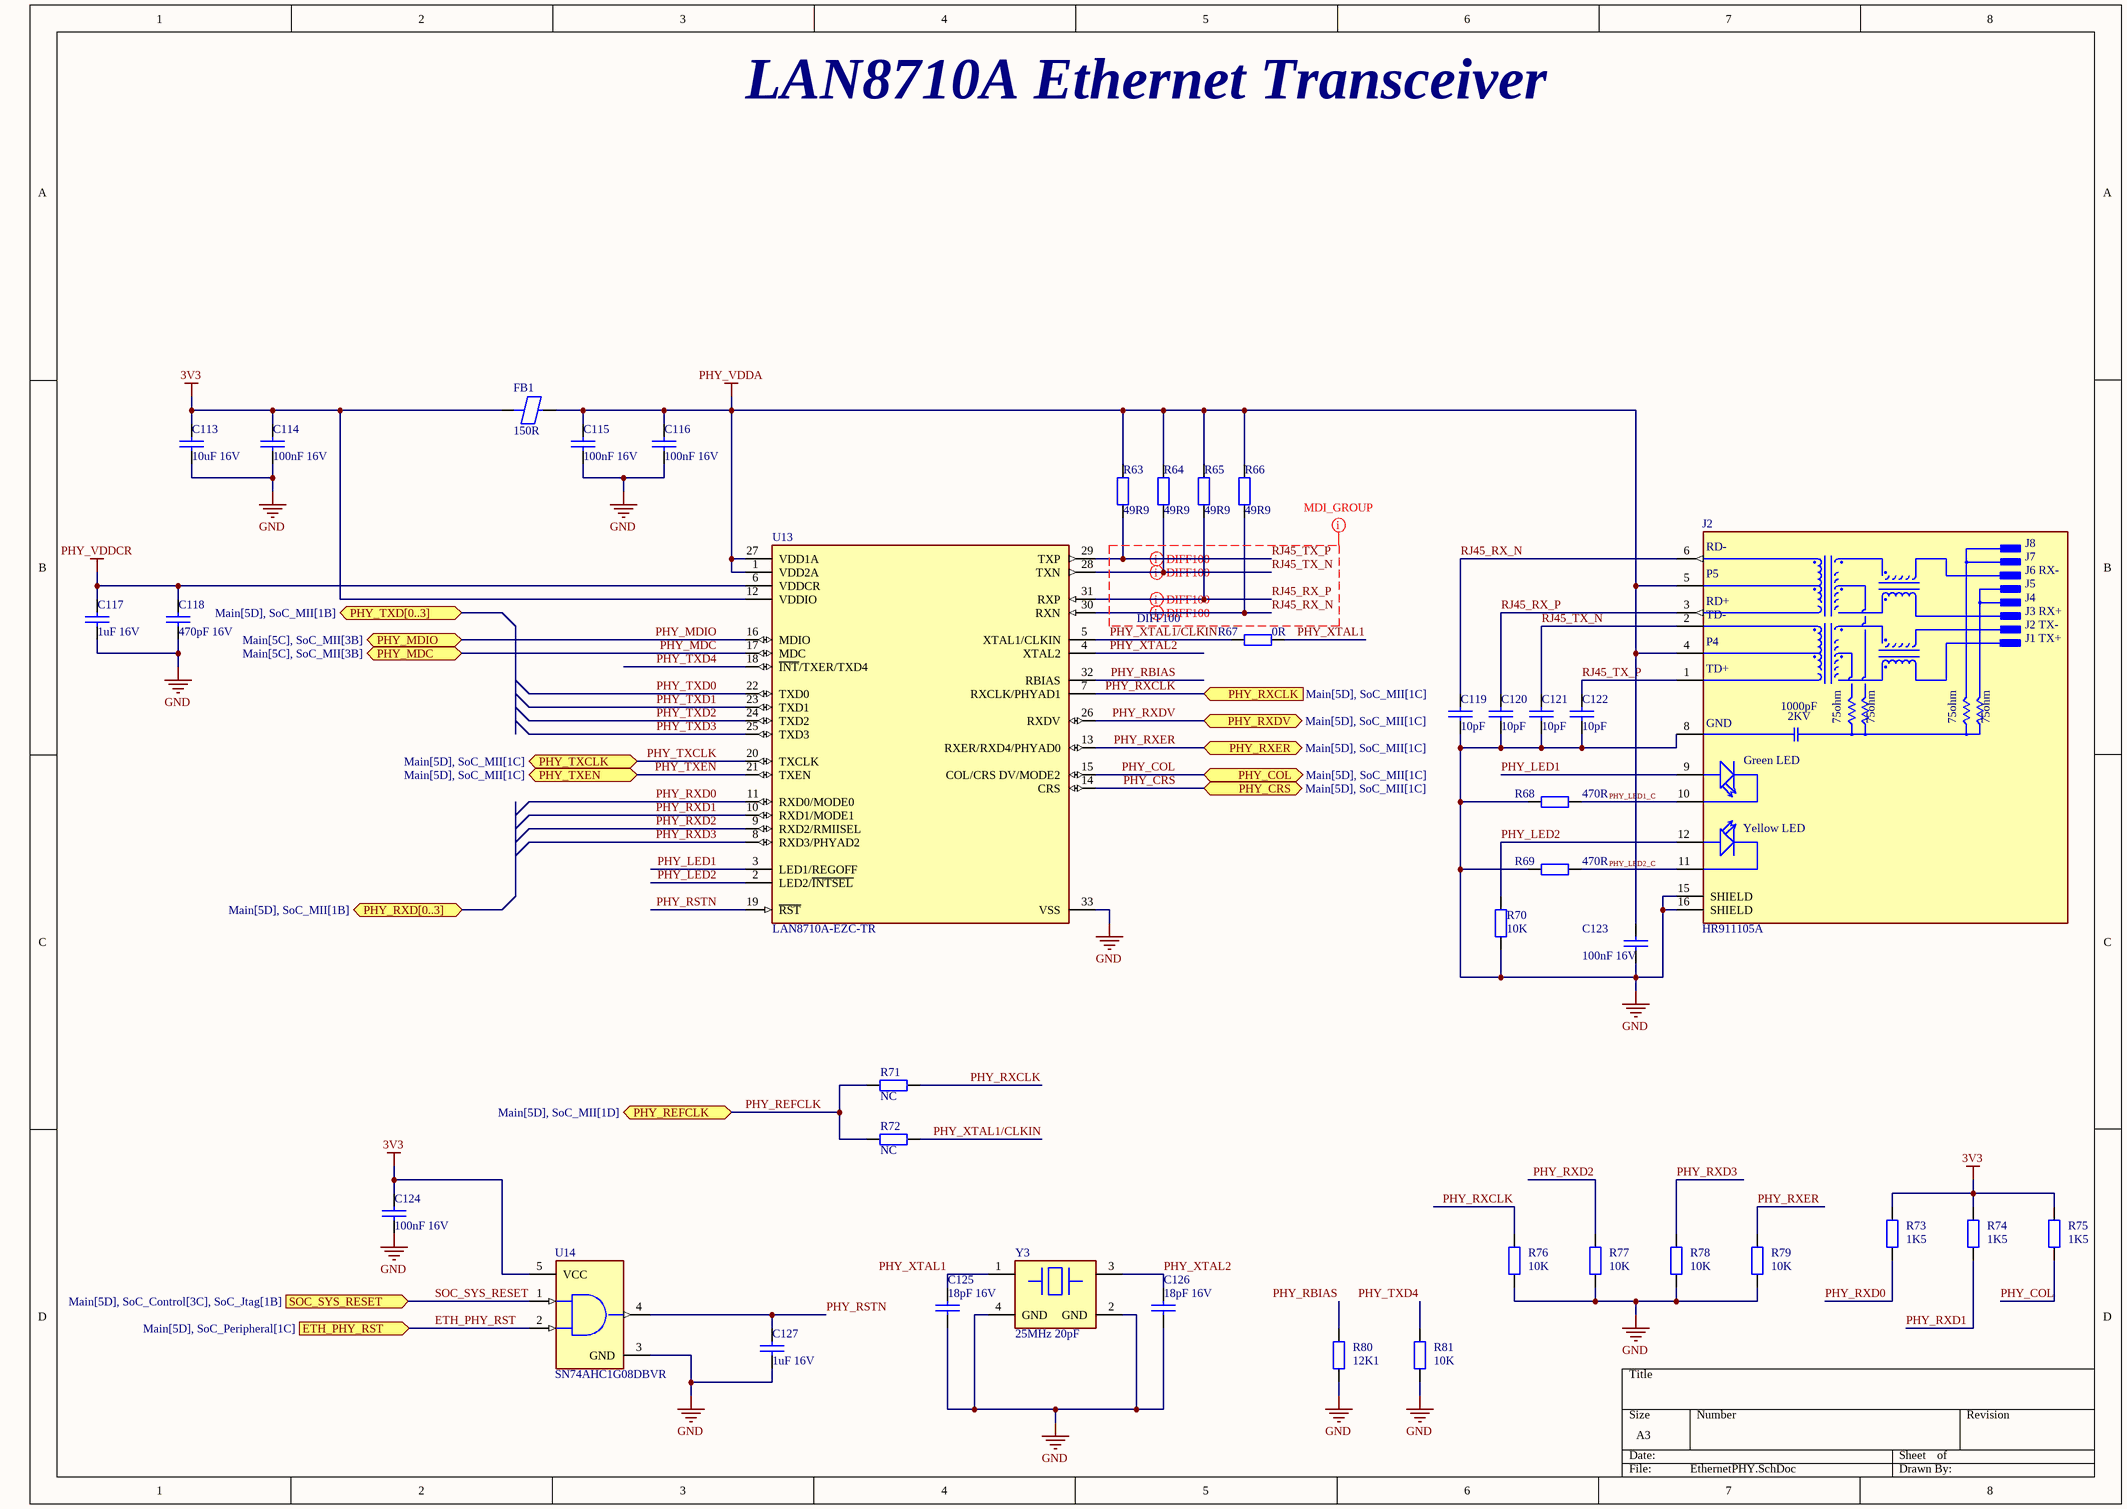
[diagram p18: EthernetPHY.SchDoc]

### Parts
C113  10uF 16V  [C_0603]
C114  100nF 16V  [C_0402]
C115  100nF 16V  [C_0402]
C116  100nF 16V  [C_0402]
C117  1uF 16V  [C_0603]
C118  470pF 16V  [C_0402]
C119  10pF  [C_0402]
C120  10pF  [C_0402]
C121  10pF  [C_0402]
C122  10pF  [C_0402]
C123  100nF 16V  [C_0402]
C124  100nF 16V  [C_0402]
C125  18pF 16V  [C_0402]
C126  18pF 16V  [C_0402]
C127  1uF 16V  [C_0603]
FB1  150R  [FB_0603]
J2  HR911105A  [HR911105A]
R63  49R9  [R_0402]
R64  49R9  [R_0402]
R65  49R9  [R_0402]
R66  49R9  [R_0402]
R67  0R  [R_0402]
R68  470R  [R_0402]
R69  470R  [R_0402]
R70  10K  [R_0402]
R71  NC  [R_0402]
R72  NC  [R_0402]
R73  1K5  [R_0402]
R74  1K5  [R_0402]
R75  1K5  [R_0402]
R76  10K  [R_0402]
R77  10K  [R_0402]
R78  10K  [R_0402]
R79  10K  [R_0402]
R80  12K1  [R_0402]
R81  10K  [R_0402]
U13  LAN8710A-EZC-TR  [FP-LAN8710A-EZC-TR-MFG]
U14  SN74AHC1G08DBVR  [FP-DBV0005A-MFG]
Y3  25MHz 20pF  [CRYSTAL_SMD3225-4P]

### Ports
ETH_PHY_RST (in, see Main[5D], SoC_Peripheral[1C]), PHY_COL (bidir, see Main[5D], SoC_MII[1C]), PHY_CRS (bidir, see Main[5D], SoC_MII[1C]), PHY_MDC (bidir, see Main[5C], SoC_MII[3B]), PHY_MDIO (bidir, see Main[5C], SoC_MII[3B]), PHY_REFCLK (bidir, see Main[5D], SoC_MII[1D]), PHY_RXCLK (in, see Main[5D], SoC_MII[1C]), PHY_RXD[0..3] (bidir, see Main[5D], SoC_MII[1B]), PHY_RXDV (bidir, see Main[5D], SoC_MII[1C]), PHY_RXER (bidir, see Main[5D], SoC_MII[1C]), PHY_TXCLK (bidir, see Main[5D], SoC_MII[1C]), PHY_TXD[0..3] (bidir, see Main[5D], SoC_MII[1B]), PHY_TXEN (bidir, see Main[5D], SoC_MII[1C]), SOC_SYS_RESET (in, see Main[5D], SoC_Control[3C], SoC_Jtag[1B])

### Nets
3V3: C113.1 C114.1 C124.1 FB1.1 R73.2 R74.2 R75.2 U13.12(VDDIO) U14.5(VCC)
GND: C113.2 C114.2 C115.2 C116.2 C117.2 C118.2 C119.2 C120.2 C121.2 C122.2 C123.2 C124.2 C125.1 C126.1 C127.2 J2.8(GND) J2.15(SHIELD) J2.16(SHIELD) R68.1 R69.1 R70.1 R76.1 R77.1 R78.1 R79.1 R80.1 R81.1 U13.33(VSS) U14.3(GND) Y3.2(GND) Y3.4(GND)
PHY_VDDA: C115.1 C116.1 C123.1 FB1.2 J2.4(P4) J2.5(P5) R63.2 R64.2 R65.2 R66.2 U13.1(VDD2A) U13.27(VDD1A)
PHY_VDDCR: C117.1 C118.1 U13.6(VDDCR)
ETH_PHY_RST: U14.2(B) ; port ETH_PHY_RST
PHY_COL: R75.1 U13.15(COL/CRS_DV/MODE2) ; port PHY_COL
PHY_CRS: U13.14(CRS) ; port PHY_CRS
PHY_LED1: J2.9(GA) U13.3(LED1/REGOFF)
PHY_LED1_C: J2.10(GC) R68.2
PHY_LED2: J2.12(YA) R70.2 U13.2(LED2/~{INTSEL})
PHY_LED2_C: J2.11(YC) R69.2
PHY_MDC: U13.17(MDC) ; port PHY_MDC
PHY_MDIO: U13.16(MDIO) ; port PHY_MDIO
PHY_RBIAS: R80.2 U13.32(RBIAS)
PHY_REFCLK: R71.2 R72.2 ; port PHY_REFCLK
PHY_RSTN: C127.1 U13.19(~{RST}) U14.4(Y)
PHY_RXCLK: R71.1 R76.2 U13.7(RXCLK/PHYAD1) ; port PHY_RXCLK
PHY_RXD0: R73.1 U13.11(RXD0/MODE0)
PHY_RXD1: R74.1 U13.10(RXD1/MODE1)
PHY_RXD2: R77.2 U13.9(RXD2/RMIISEL)
PHY_RXD3: R78.2 U13.8(RXD3/PHYAD2)
PHY_RXDV: U13.26(RXDV) ; port PHY_RXDV
PHY_RXER: R79.2 U13.13(RXER/RXD4/PHYAD0) ; port PHY_RXER
PHY_TXCLK: U13.20(TXCLK) ; port PHY_TXCLK
PHY_TXD0: U13.22(TXD0)
PHY_TXD1: U13.23(TXD1)
PHY_TXD2: U13.24(TXD2)
PHY_TXD3: U13.25(TXD3)
PHY_TXD4: R81.2 U13.18(~{INT}/TXER/TXD4)
PHY_TXEN: U13.21(TXEN) ; port PHY_TXEN
PHY_XTAL1: C125.2 R67.2 Y3.1(CRYSTAL_1)
PHY_XTAL1/CLKIN: R67.1 R72.1 U13.5(XTAL1/CLKIN)
PHY_XTAL2: C126.2 U13.4(XTAL2) Y3.3(CRYSTAL_2)
RJ45_RX_N: C119.1 J2.6(RD-) R66.1 U13.30(RXN)
RJ45_RX_P: C120.1 J2.3(RD+) R65.1 U13.31(RXP)
RJ45_TX_N: C121.1 J2.2(TD-) R64.1 U13.28(TXN)
RJ45_TX_P: C122.1 J2.1(TD+) R63.1 U13.29(TXP)
SOC_SYS_RESET: U14.1(A) ; port SOC_SYS_RESET

### Layout directives
net class MDI_GROUP: RJ45_RX_N, RJ45_RX_P, RJ45_TX_N, RJ45_TX_P
differential pair; differential pair class DIFF100: RJ45_RX_N, RJ45_RX_P, RJ45_TX_N, RJ45_TX_P

### Notes on the sheet
- LAN8710A Ethernet Transceiver
- (in symbol HR911105A) J8; J7; J6 RX-; J5; J4; J3 RX+; J2 TX-; J1 TX+; 1000pF; 2KV; 75ohm; Green LED; Yellow LED

### Library data of the parts
C113 C117 C127 = C_0603: Capacitor 0603 SMD
C114-C116 C118-C126 = C_0402: Capacitor 0402 SMD
FB1 = FB_0603: Ferrite Beads 0603 SMD
J2 = HR911105A: RJ45Receptacle 1 WithLED Plugin Ethernet Connectors / Modular Connectors (RJ45 RJ11) ROHS; Manufaacturer: HANRUN(Zhongshan HanRun Elec); Manufacturer Part Number: HR911105A; ComponentLink1Description: Datasheet Link; ComponentLink1URL: https://www.lcsc.com/datasheet/lcsc_datasheet_2409302333_HANRUN-Zhongshan-HanRun-Elec-HR911105A_C12074.pdf
R63-R81 = R_0402: Resistor 0402 SMD
U13 = CMP-0186-00334-2: IC TRANSCEIVER FULL 4/4 32QFN; Number of Channels: 1; Max Supply Current: 24.1mA; Min Supply Voltage: 1.62V; Simplex/Duplex: Full Duplex; Max Power Dissipation: 176mW; Number of LEDs: 4; Max Supply Voltage: 3.6V; Data Rate: 100Mbps; Number of Pins: 32; Package Quantity: 4000; Number of Transceivers: 1; Height: 0.95mm; Packaging: Tape and Reel; Case/Package: QFN; Min Operating Temperature: 0°C; Max Operating Temperature: 85°C; Lead Free: Lead Free; Length: 5.1mm; Width: 5.1mm
U14 = CMP-0859-00043-4: IC GATE AND 1CH 2-INP SOT23-5; Manufacturer: Texas Instruments; Number Of Outputs: 1; Nominal Supply Current: 1uA; Standoff Height: 0mm; Max Supply Voltage: 5.5V; Min Supply Voltage: 2V; Max Junction Temp: +150°C; Propagation Delay: 5.8ns; Number Of Inputs: 2; Logic Function Desc: Non-Inverting; Device Class L3: Logic Gates; Category: IC; ComponentLink2Description: Datasheet; Device Class L2: Logic ICs; RoHS: TRUE; Device Class L1: Integrated Circuits (ICs); Manufacturer Part Number: SN74AHC1G08DBVR; Temperature Range Low: -55°C; Number Of Circuits: 1; Automotive: No; Lead Free: Yes; Temperature Range High: +125°C; Digikey Description: IC GATE AND 1CH 2-INP SOT23-5; Ambient Temperature Range High: +125°C; Ambient Temperature Range Low: -55°C; Package: DBV0005A; Mouser Description: AND Gate 1-Element 2-IN CMOS 5-Pin SOT-23 AND Gate 1-Element 2-IN CMOS 5-Pin SOT-23 AND Gate 1-Element 2-IN CMOS 5-Pi...; ComponentLink2URL: http://www.ti.com/lit/ds/symlink/sn74ahc1g08.pdf; Height: 1.45mm; Temperature: -55°C to +125°C; Octopart: https://octopart.com/sn74ahc1g08dbvr-texas+instruments-464404
Y3 = X322525MSB4SI: 25MHz Surface Mount Crystal 20pF ±10ppm ±20ppm SMD3225-4P Crystals ROHS; Manufacturer: YXC Crystal Oscillators; Manufacturer Part Number: X322525MSB4SI; ComponentLink1Description: Datasheet Link; ComponentLink1URL: https://www.lcsc.com/datasheet/lcsc_datasheet_2411121006_YXC-Crystal-Oscillators-X322525MSB4SI_C13740.pdf

## Sheet SoC_MII.SchDoc
size A4; SheetNumber: 20; SheetTotal: 22
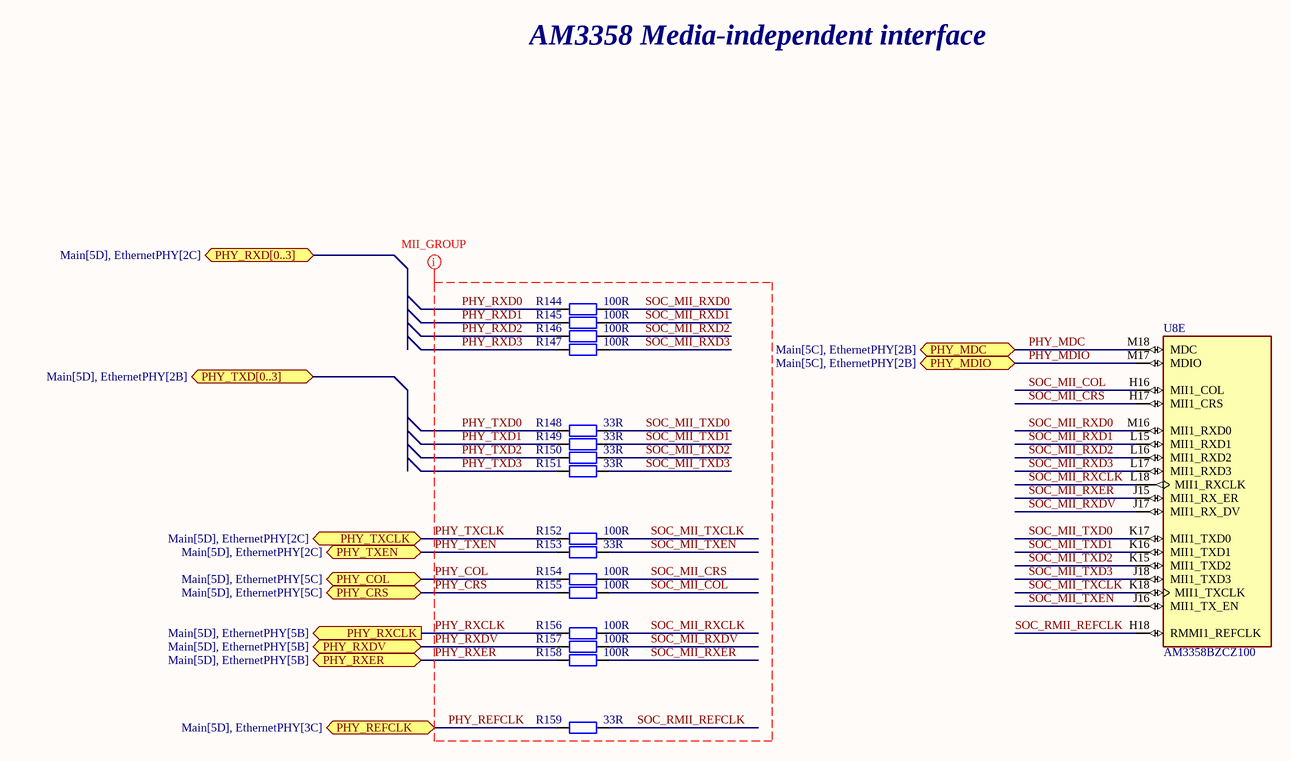
[diagram p19: SoC_MII.SchDoc]

### Parts
R144  100R  [R_0402]
R145  100R  [R_0402]
R146  100R  [R_0402]
R147  100R  [R_0402]
R148  33R  [R_0402]
R149  33R  [R_0402]
R150  33R  [R_0402]
R151  33R  [R_0402]
R152  100R  [R_0402]
R153  33R  [R_0402]
R154  100R  [R_0402]
R155  100R  [R_0402]
R156  100R  [R_0402]
R157  100R  [R_0402]
R158  100R  [R_0402]
R159  33R  [R_0402]
U8  AM3358BZCZ100  [BGA324C80P18X18_1500X1500X140]  (part E of 9)

### Ports
PHY_COL (bidir, see Main[5D], EthernetPHY[5C]), PHY_CRS (bidir, see Main[5D], EthernetPHY[5C]), PHY_MDC (bidir, see Main[5C], EthernetPHY[2B]), PHY_MDIO (bidir, see Main[5C], EthernetPHY[2B]), PHY_REFCLK (bidir, see Main[5D], EthernetPHY[3C]), PHY_RXCLK (out, see Main[5D], EthernetPHY[5B]), PHY_RXD[0..3] (bidir, see Main[5D], EthernetPHY[2C]), PHY_RXDV (bidir, see Main[5D], EthernetPHY[5B]), PHY_RXER (bidir, see Main[5D], EthernetPHY[5B]), PHY_TXCLK (bidir, see Main[5D], EthernetPHY[2C]), PHY_TXD[0..3] (bidir, see Main[5D], EthernetPHY[2B]), PHY_TXEN (bidir, see Main[5D], EthernetPHY[2C])

### Nets
PHY_COL: R154.1 ; port PHY_COL
PHY_CRS: R155.1 ; port PHY_CRS
PHY_MDC: U8.M18(MDC) ; port PHY_MDC
PHY_MDIO: U8.M17(MDIO) ; port PHY_MDIO
PHY_REFCLK: R159.1 ; port PHY_REFCLK
PHY_RXCLK: R156.1 ; port PHY_RXCLK
PHY_RXD0: R144.1
PHY_RXD1: R145.1
PHY_RXD2: R146.1
PHY_RXD3: R147.1
PHY_RXDV: R157.1 ; port PHY_RXDV
PHY_RXER: R158.1 ; port PHY_RXER
PHY_TXCLK: R152.1 ; port PHY_TXCLK
PHY_TXD0: R148.1
PHY_TXD1: R149.1
PHY_TXD2: R150.1
PHY_TXD3: R151.1
PHY_TXEN: R153.1 ; port PHY_TXEN
SOC_MII_COL: R155.2 U8.H16(MII1_COL)
SOC_MII_CRS: R154.2 U8.H17(MII1_CRS)
SOC_MII_RXCLK: R156.2 U8.L18(MII1_RXCLK)
SOC_MII_RXD0: R144.2 U8.M16(MII1_RXD0)
SOC_MII_RXD1: R145.2 U8.L15(MII1_RXD1)
SOC_MII_RXD2: R146.2 U8.L16(MII1_RXD2)
SOC_MII_RXD3: R147.2 U8.L17(MII1_RXD3)
SOC_MII_RXDV: R157.2 U8.J17(MII1_RX_DV)
SOC_MII_RXER: R158.2 U8.J15(MII1_RX_ER)
SOC_MII_TXCLK: R152.2 U8.K18(MII1_TXCLK)
SOC_MII_TXD0: R148.2 U8.K17(MII1_TXD0)
SOC_MII_TXD1: R149.2 U8.K16(MII1_TXD1)
SOC_MII_TXD2: R150.2 U8.K15(MII1_TXD2)
SOC_MII_TXD3: R151.2 U8.J18(MII1_TXD3)
SOC_MII_TXEN: R153.2 U8.J16(MII1_TX_EN)
SOC_RMII_REFCLK: R159.2 U8.H18(RMMI1_REFCLK)

### Layout directives
net class MII_GROUP: PHY_COL, PHY_CRS, PHY_REFCLK, PHY_RXCLK, PHY_RXD0, PHY_RXD1, PHY_RXD2, PHY_RXD3, PHY_RXDV, PHY_RXER, PHY_TXCLK, PHY_TXD0, PHY_TXD1, PHY_TXD2, PHY_TXD3, PHY_TXEN, SOC_MII_COL, SOC_MII_CRS, SOC_MII_RXCLK, SOC_MII_RXD0, SOC_MII_RXD1, SOC_MII_RXD2, SOC_MII_RXD3, SOC_MII_RXDV, SOC_MII_RXER, SOC_MII_TXCLK, SOC_MII_TXD0, SOC_MII_TXD1, SOC_MII_TXD2, SOC_MII_TXD3, SOC_MII_TXEN, SOC_RMII_REFCLK

### Notes on the sheet
- AM3358 Media-independent interface

### Library data of the parts
R144-R159 = R_0402: Resistor 0402 SMD
U8 = AM3358BZCZ100: ARM-ASeries 1GHz NFBGA-324 Microcontrollers (MCU/MPU/SOC) ROHS; Manufacturer: Texas Instruments; Manufacturer Part Number: AM3358BZCZ100; Datasheet Link: https://www.ti.com/lit/ds/symlink/am3358.pdf

## Sheet SoC_Jtag.SchDoc
size A4; SheetNumber: 22; SheetTotal: 22
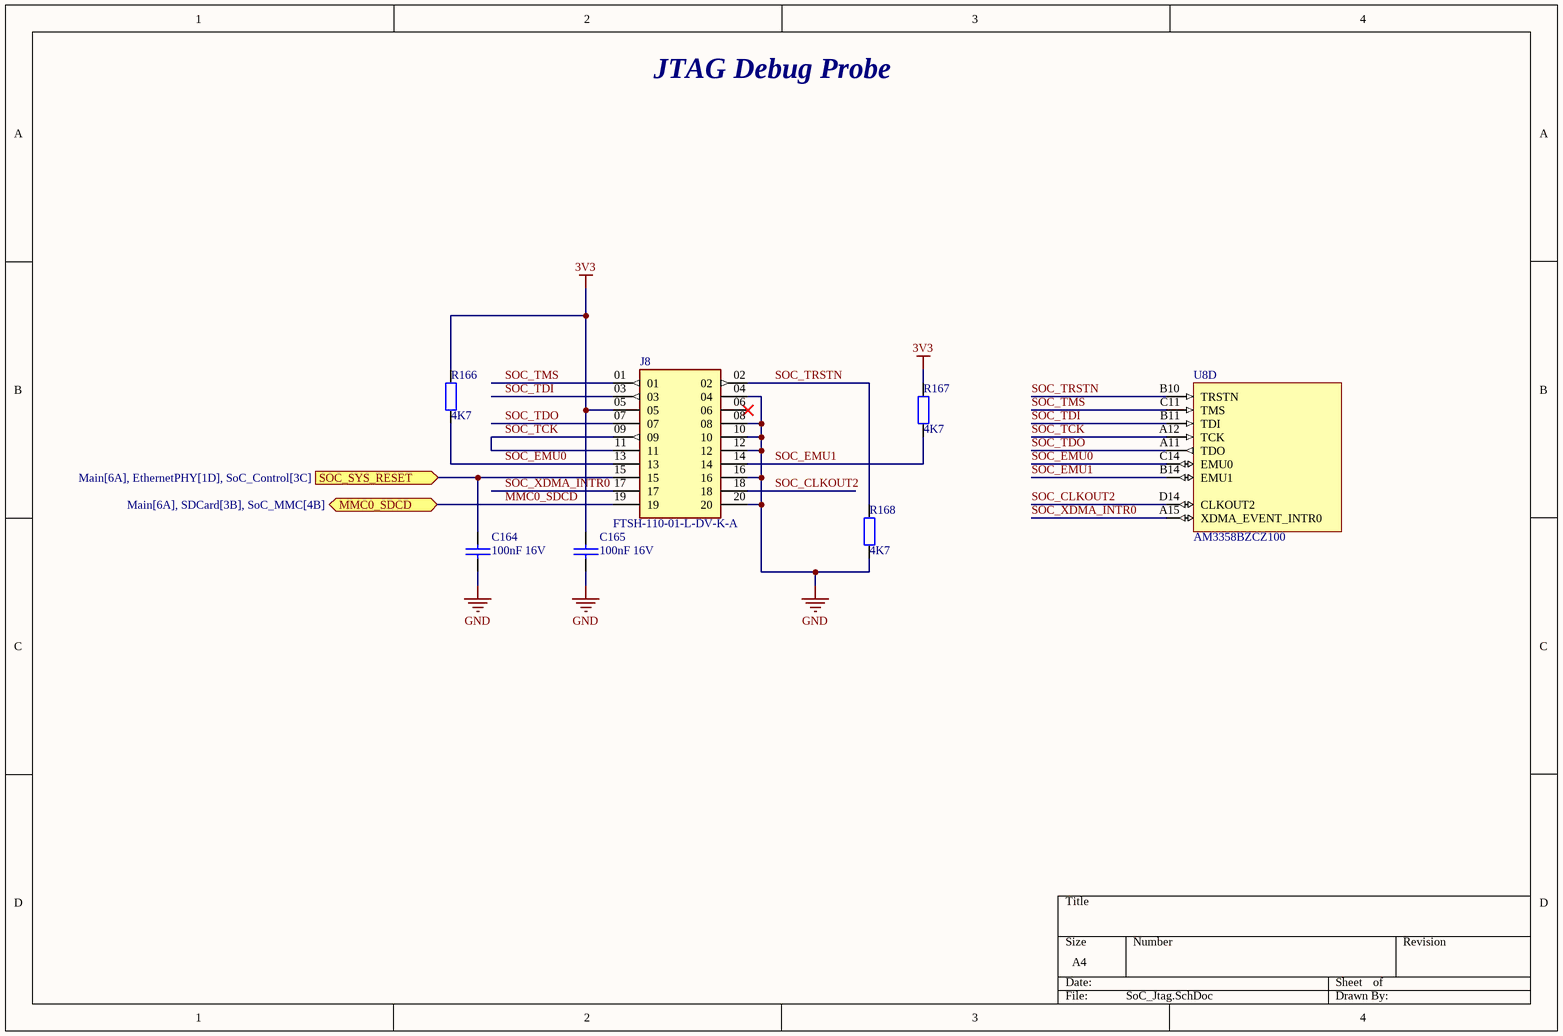
[diagram p20: SoC_Jtag.SchDoc]

### Parts
C164  100nF 16V  [C_0402]
C165  100nF 16V  [C_0402]
J8  FTSH-110-01-L-DV-K-A  [FTSH-110-01-L-DV-K-A]
R166  4K7  [R_0402]
R167  4K7  [R_0402]
R168  4K7  [R_0402]
U8  AM3358BZCZ100  [BGA324C80P18X18_1500X1500X140]  (part D of 9)

### Ports
MMC0_SDCD (bidir, see Main[6A], SDCard[3B], SoC_MMC[4B]), SOC_SYS_RESET (in, see Main[6A], EthernetPHY[1D], SoC_Control[3C])

### Nets
3V3: C165.1 J8.05 R166.2 R167.2
GND: C164.2 C165.2 J8.04 J8.08 J8.10 J8.12 J8.16 J8.20 R168.1
MMC0_SDCD: J8.19 ; port MMC0_SDCD
SOC_CLKOUT2: J8.18 U8.D14(CLKOUT2)
SOC_EMU0: J8.13 R166.1 U8.C14(EMU0)
SOC_EMU1: J8.14 R167.1 U8.B14(EMU1)
SOC_SYS_RESET: C164.1 J8.15 ; port SOC_SYS_RESET
SOC_TCK: J8.09 J8.11 U8.A12(TCK)
SOC_TDI: J8.03 U8.B11(TDI)
SOC_TDO: J8.07 U8.A11(TDO)
SOC_TMS: J8.01 U8.C11(TMS)
SOC_TRSTN: J8.02 R168.2 U8.B10(TRSTN)
SOC_XDMA_INTR0: J8.17 U8.A15(XDMA_EVENT_INTR0)

Not connected (* = marked no-connect by the designer): J8 06*

### Notes on the sheet
- JTAG Debug Probe

### Library data of the parts
C164 C165 = C_0402: Capacitor 0402 SMD
J8 = FTSH-110-01-L-DV-K-A: Connector Header Surface Mount 20 position 0.050" (1.27mm)
R166-R168 = R_0402: Resistor 0402 SMD
U8 = AM3358BZCZ100: as U8 on sheet SoC_MII; Manufacturer Part Number: AM3358BZCZ100; Datasheet Link: https://www.ti.com/lit/ds/symlink/am3358.pdf

## Sheet SDCard.SchDoc
size A4; SheetNumber: 9; SheetTotal: 22
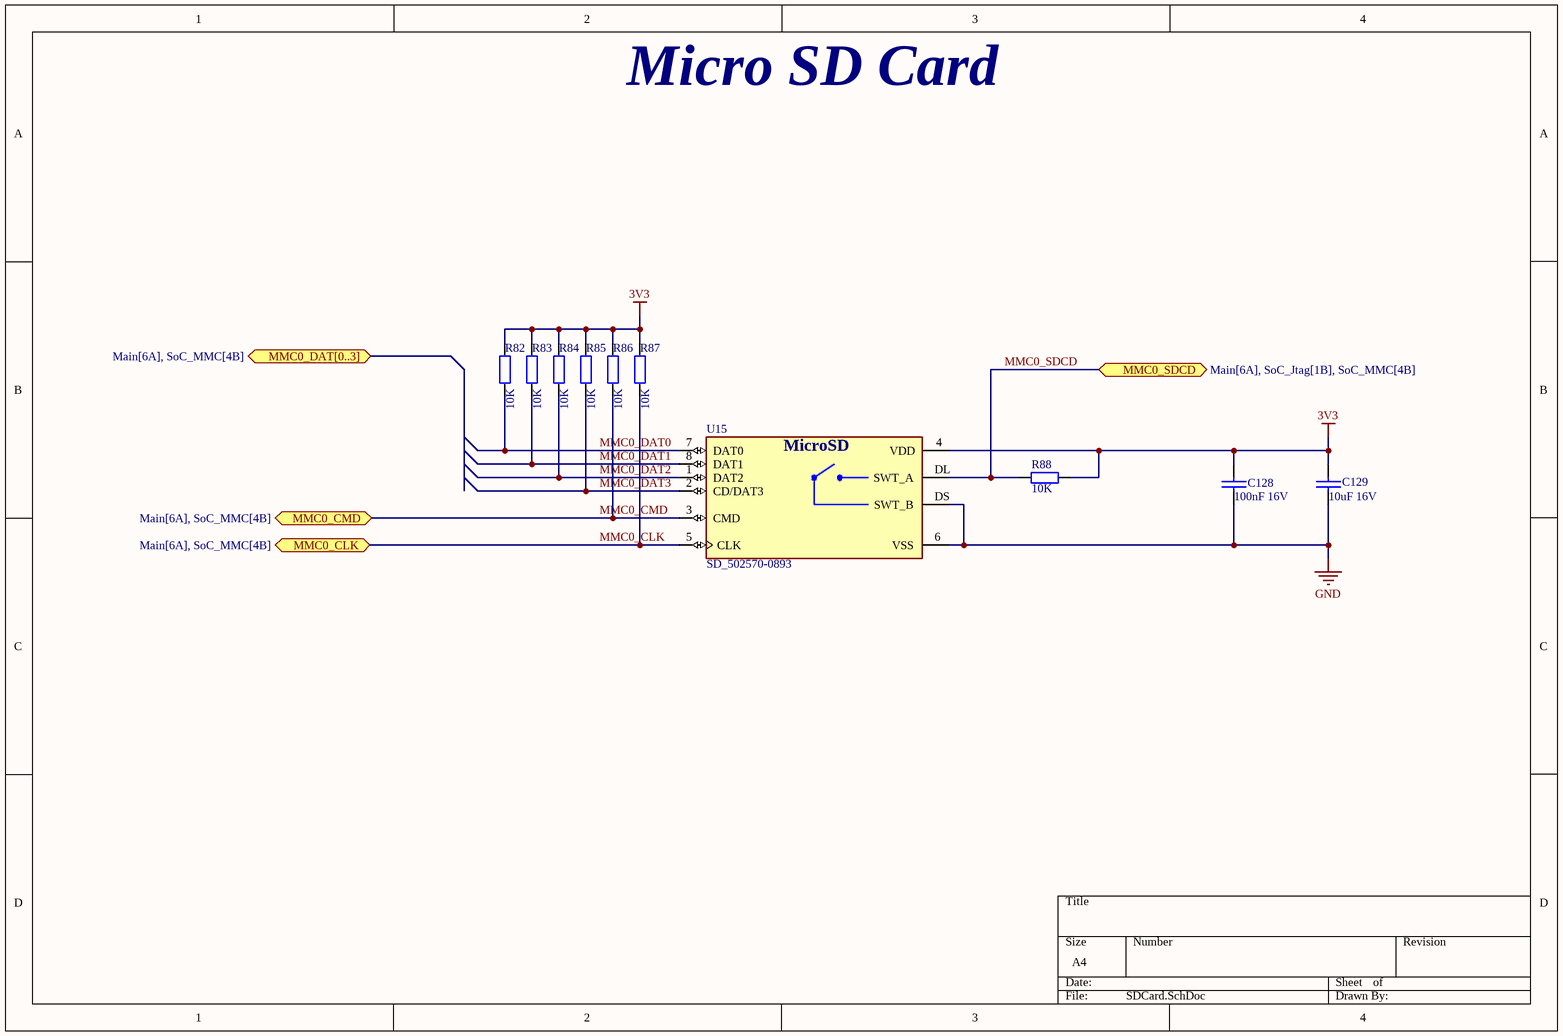
[diagram p21: SDCard.SchDoc]

### Parts
C128  100nF 16V  [C_0402]
C129  10uF 16V  [C_0603]
R82  10K  [R_0402]
R83  10K  [R_0402]
R84  10K  [R_0402]
R85  10K  [R_0402]
R86  10K  [R_0402]
R87  10K  [R_0402]
R88  10K  [R_0402]
U15  SD_502570-0893  [MOLEX_502570-0893]

### Ports
MMC0_CLK (bidir, see Main[6A], SoC_MMC[4B]), MMC0_CMD (bidir, see Main[6A], SoC_MMC[4B]), MMC0_DAT[0..3] (bidir, see Main[6A], SoC_MMC[4B]), MMC0_SDCD (bidir, see Main[6A], SoC_Jtag[1B], SoC_MMC[4B])

### Nets
3V3: C128.1 C129.1 R82.2 R83.2 R84.2 R85.2 R86.2 R87.2 R88.2 U15.4(VDD)
GND: C128.2 C129.2 U15.6(VSS) U15.DS(SWT_B)
MMC0_CLK: R87.1 U15.5(CLK) ; port MMC0_CLK
MMC0_CMD: R86.1 U15.3(CMD) ; port MMC0_CMD
MMC0_DAT0: R82.1 U15.7(DAT0)
MMC0_DAT1: R83.1 U15.8(DAT1)
MMC0_DAT2: R84.1 U15.1(DAT2)
MMC0_DAT3: R85.1 U15.2(CD/DAT3)
MMC0_SDCD: R88.1 U15.DL(SWT_A) ; port MMC0_SDCD

### Notes on the sheet
- Micro SD Card
- (in symbol SD_502570-0893) MicroSD

### Library data of the parts
C128 = C_0402: Capacitor 0402 SMD
C129 = C_0603: Capacitor 0603 SMD
R82-R88 = R_0402: Resistor 0402 SMD
U15 = SD_502570-0893: Conn IC Socket SD Memory Cd Micro 1.10mm 8Cir Norm Mnt SMT Push-Push LF | Molex Incorporated 502570-0893; Manufacturer: Molex; Manufacturer Part Number: 502570-0893; Datasheet Link: https://www.molex.com/en-us/products/part-detail/5025700893

## Nets that join several sheets
3V3: PowerSupplies (C30.1 C31.1 L5.2 R7.2), eMMCChip (28 pins), SoC_Peripheral (5 pins), USBHub (C133.1 R89.2 R94.1 U16.20), GNSSModule (6 pins), WIFIModule (13 pins), EEPROM (C160.1 U25.4), EthernetPHY (9 pins), SoC_Jtag (C165.1 J8.05 R166.2 R167.2), SDCard (10 pins)
3V7: PowerSupplies (C34.1 L6.2 R9.2), LTEModule (7 pins)
5V_SYS: PMIC (15 pins), PowerSupplies (C29.1 C33.1 U6.3 U7.3), SoC_Peripheral (C163.1 J7.01 U8.P15), USBHub (8 pins), LTEModule (C136.1 U19.24)
5VIN: PMIC (C8.1 U4.10), PowerSupplies (C26.1 C27.1 L4.2 R4.2)
DDR_VREF: DDR3LChip (6 pins), SoC_DDR (C161.1 U8.J4)
GND: DDR3LChip (27 pins), SoC_DDR (C161.2 R120.1), InputConnectors (21 pins), PMIC (25 pins), PowerSupplies (16 pins), SoC_BootMode (17 pins), SoC_Power (93 pins), SoC_Control (11 pins), eMMCChip (22 pins), SoC_Peripheral (7 pins), USBHub (16 pins), GNSSModule (15 pins), LTEModule (61 pins), WIFIModule (20 pins), EEPROM (C160.2 R119.2 U25.2), EthernetPHY (31 pins), SoC_Jtag (9 pins), SDCard (C128.2 C129.2 U15.6 U15.DS)
LDO_1V8: PMIC (C17.1 U4.18 U4.40), SoC_Power (16 pins)
LDO_1V8_RTC: PMIC (C19.1 U4.3), SoC_Power (15 pins), SoC_Control (R13.2 U9.5)
LDO_3V3: PMIC (C16.1 U4.43), PowerSupplies (R6.2 R10.2 U6.5 U7.5), SoC_BootMode (16 pins), SoC_Power (34 pins), SoC_Control (R12.2 R14.2), SoC_Peripheral (R160.2 R161.2)
VBUS_IN: InputConnectors (8 pins), PMIC (C7.1 U4.12)
VBUS_OUT: SoC_Peripheral (C162.1 U8.T18), USBHub (J3.1 U17.1 U18.5)
VCCIN: InputConnectors (C4.1 J1.1), PowerSupplies (C25.1 U5.3)
VDD_1V1_CORE: PMIC (C20.1 L3.2 U4.29), SoC_Power (31 pins)
VDD_1V1_MPU: PMIC (C21.1 L2.2 U4.24), SoC_Power (11 pins)
VDD_1V5_DDR3L: DDR3LChip (31 pins), PMIC (C22.1 L1.2 U4.19), SoC_Power (12 pins)
DDR3L_CASN: DDR3LChip (U10.K3), SoC_DDR (U8.F1)
DDR3L_CLK_N: DDR3LChip (U10.K7), SoC_DDR (U8.D1)
DDR3L_CLK_P: DDR3LChip (U10.J7), SoC_DDR (U8.D2)
DDR3L_CSE: DDR3LChip (U10.K9), SoC_DDR (U8.G3)
DDR3L_CSN: DDR3LChip (U10.L2), SoC_DDR (U8.H2)
DDR3L_DQM0: DDR3LChip (U10.D3), SoC_DDR (U8.M2)
DDR3L_DQM1: DDR3LChip (U10.E7), SoC_DDR (U8.J2)
DDR3L_DQS0_N: DDR3LChip (U10.B7), SoC_DDR (U8.P2)
DDR3L_DQS0_P: DDR3LChip (U10.C7), SoC_DDR (U8.P1)
DDR3L_DQS1_N: DDR3LChip (U10.G3), SoC_DDR (U8.L2)
DDR3L_DQS1_P: DDR3LChip (U10.F3), SoC_DDR (U8.L1)
DDR3L_ODT: DDR3LChip (U10.K1), SoC_DDR (U8.G1)
DDR3L_RASN: DDR3LChip (U10.J3), SoC_DDR (U8.G4)
DDR3L_RESETN: DDR3LChip (U10.T2), SoC_DDR (U8.G2)
DDR3L_WEN: DDR3LChip (U10.L3), SoC_DDR (U8.B2)
EMMC_RSTN_BUF: eMMCChip (U12.2), SoC_Peripheral (U8.R14)
ETH_PHY_RST: SoC_Peripheral (U8.E18), EthernetPHY (U14.2)
F9P_USB_N: USBHub (U16.11), GNSSModule (U23.5)
F9P_USB_P: USBHub (U16.12), GNSSModule (U23.6)
I2C0_SCL: PMIC (U4.28), SoC_Peripheral (R160.1 U8.C16), EEPROM (U25.1)
I2C0_SDA: PMIC (U4.27), SoC_Peripheral (R161.1 U8.C17), EEPROM (U25.3)
LTE_PWRKEY_CNTRL: SoC_Peripheral (U8.U17), LTEModule (R100.1 U20.1)
MMC0_CLK: SoC_MMC (R133.2), SDCard (R87.1 U15.5)
MMC0_CMD: SoC_MMC (R130.2), SDCard (R86.1 U15.3)
MMC0_SDCD: SoC_MMC (R135.2), SoC_Jtag (J8.19), SDCard (R88.1 U15.DL)
MMC1_CLK: eMMCChip (R53.1 U11.M6), SoC_MMC (R138.1)
MMC1_CMD: eMMCChip (R54.1 U11.M5), SoC_MMC (R136.1)
MMC2_CLK: SoC_MMC (R143.2), WIFIModule (R111.1 U24.17)
MMC2_CMD: SoC_MMC (R142.2), WIFIModule (R112.1 U24.16)
PHY_COL: EthernetPHY (R75.1 U13.15), SoC_MII (R154.1)
PHY_CRS: EthernetPHY (U13.14), SoC_MII (R155.1)
PHY_MDC: EthernetPHY (U13.17), SoC_MII (U8.M18)
PHY_MDIO: EthernetPHY (U13.16), SoC_MII (U8.M17)
PHY_REFCLK: EthernetPHY (R71.2 R72.2), SoC_MII (R159.1)
PHY_RXCLK: EthernetPHY (R71.1 R76.2 U13.7), SoC_MII (R156.1)
PHY_RXDV: EthernetPHY (U13.26), SoC_MII (R157.1)
PHY_RXER: EthernetPHY (R79.2 U13.13), SoC_MII (R158.1)
PHY_TXCLK: EthernetPHY (U13.20), SoC_MII (R152.1)
PHY_TXEN: EthernetPHY (U13.21), SoC_MII (R153.1)
SOC_EXT_WAKEUP: PMIC (U4.13), SoC_Control (R13.1 U8.C5)
SOC_EXTINTN: PMIC (U4.45), SoC_Control (R12.1 U8.B18)
SOC_PMIC_PWR_EN: PMIC (U4.9), SoC_Control (U8.C6)
SOC_PWR_ONRSTN: PMIC (U4.26), SoC_Control (U8.B15 U9.2)
SOC_RTC_PWRONRSTN: PMIC (U4.46), SoC_Control (U8.B5)
SOC_SYS_RESET: SoC_Control (6 pins), EthernetPHY (U14.1), SoC_Jtag (C164.1 J8.15)
SOC_UART1_RX: SoC_Peripheral (U8.D16), GNSSModule (U23.20)
SOC_UART1_TX: SoC_Peripheral (U8.D15), GNSSModule (U23.21)
UART0_RX: InputConnectors (U1.26), SoC_Peripheral (U8.E15)
UART0_TX: InputConnectors (U1.25), SoC_Peripheral (U8.E16)
USB0_N: SoC_Peripheral (U8.N18), LTEModule (U19.28)
USB0_P: SoC_Peripheral (U8.N17), LTEModule (U19.27)
USB1_DRVVBUS: SoC_Peripheral (U8.F15), USBHub (R92.1 U17.4)
USB1_N: SoC_Peripheral (U8.R18), USBHub (U16.14)
USB1_OCN: SoC_Peripheral (U8.T17), USBHub (R94.2 U17.3)
USB1_P: SoC_Peripheral (U8.R17), USBHub (U16.15)
WIFI_HOST_WAKE: SoC_Peripheral (U8.T11), WIFIModule (U24.13)
WIFI_REG_ON: SoC_Peripheral (U8.U12), WIFIModule (U24.12)